# EAGLE board M8650D+vrs (EAGLE 6.6.0), part 1 of 2
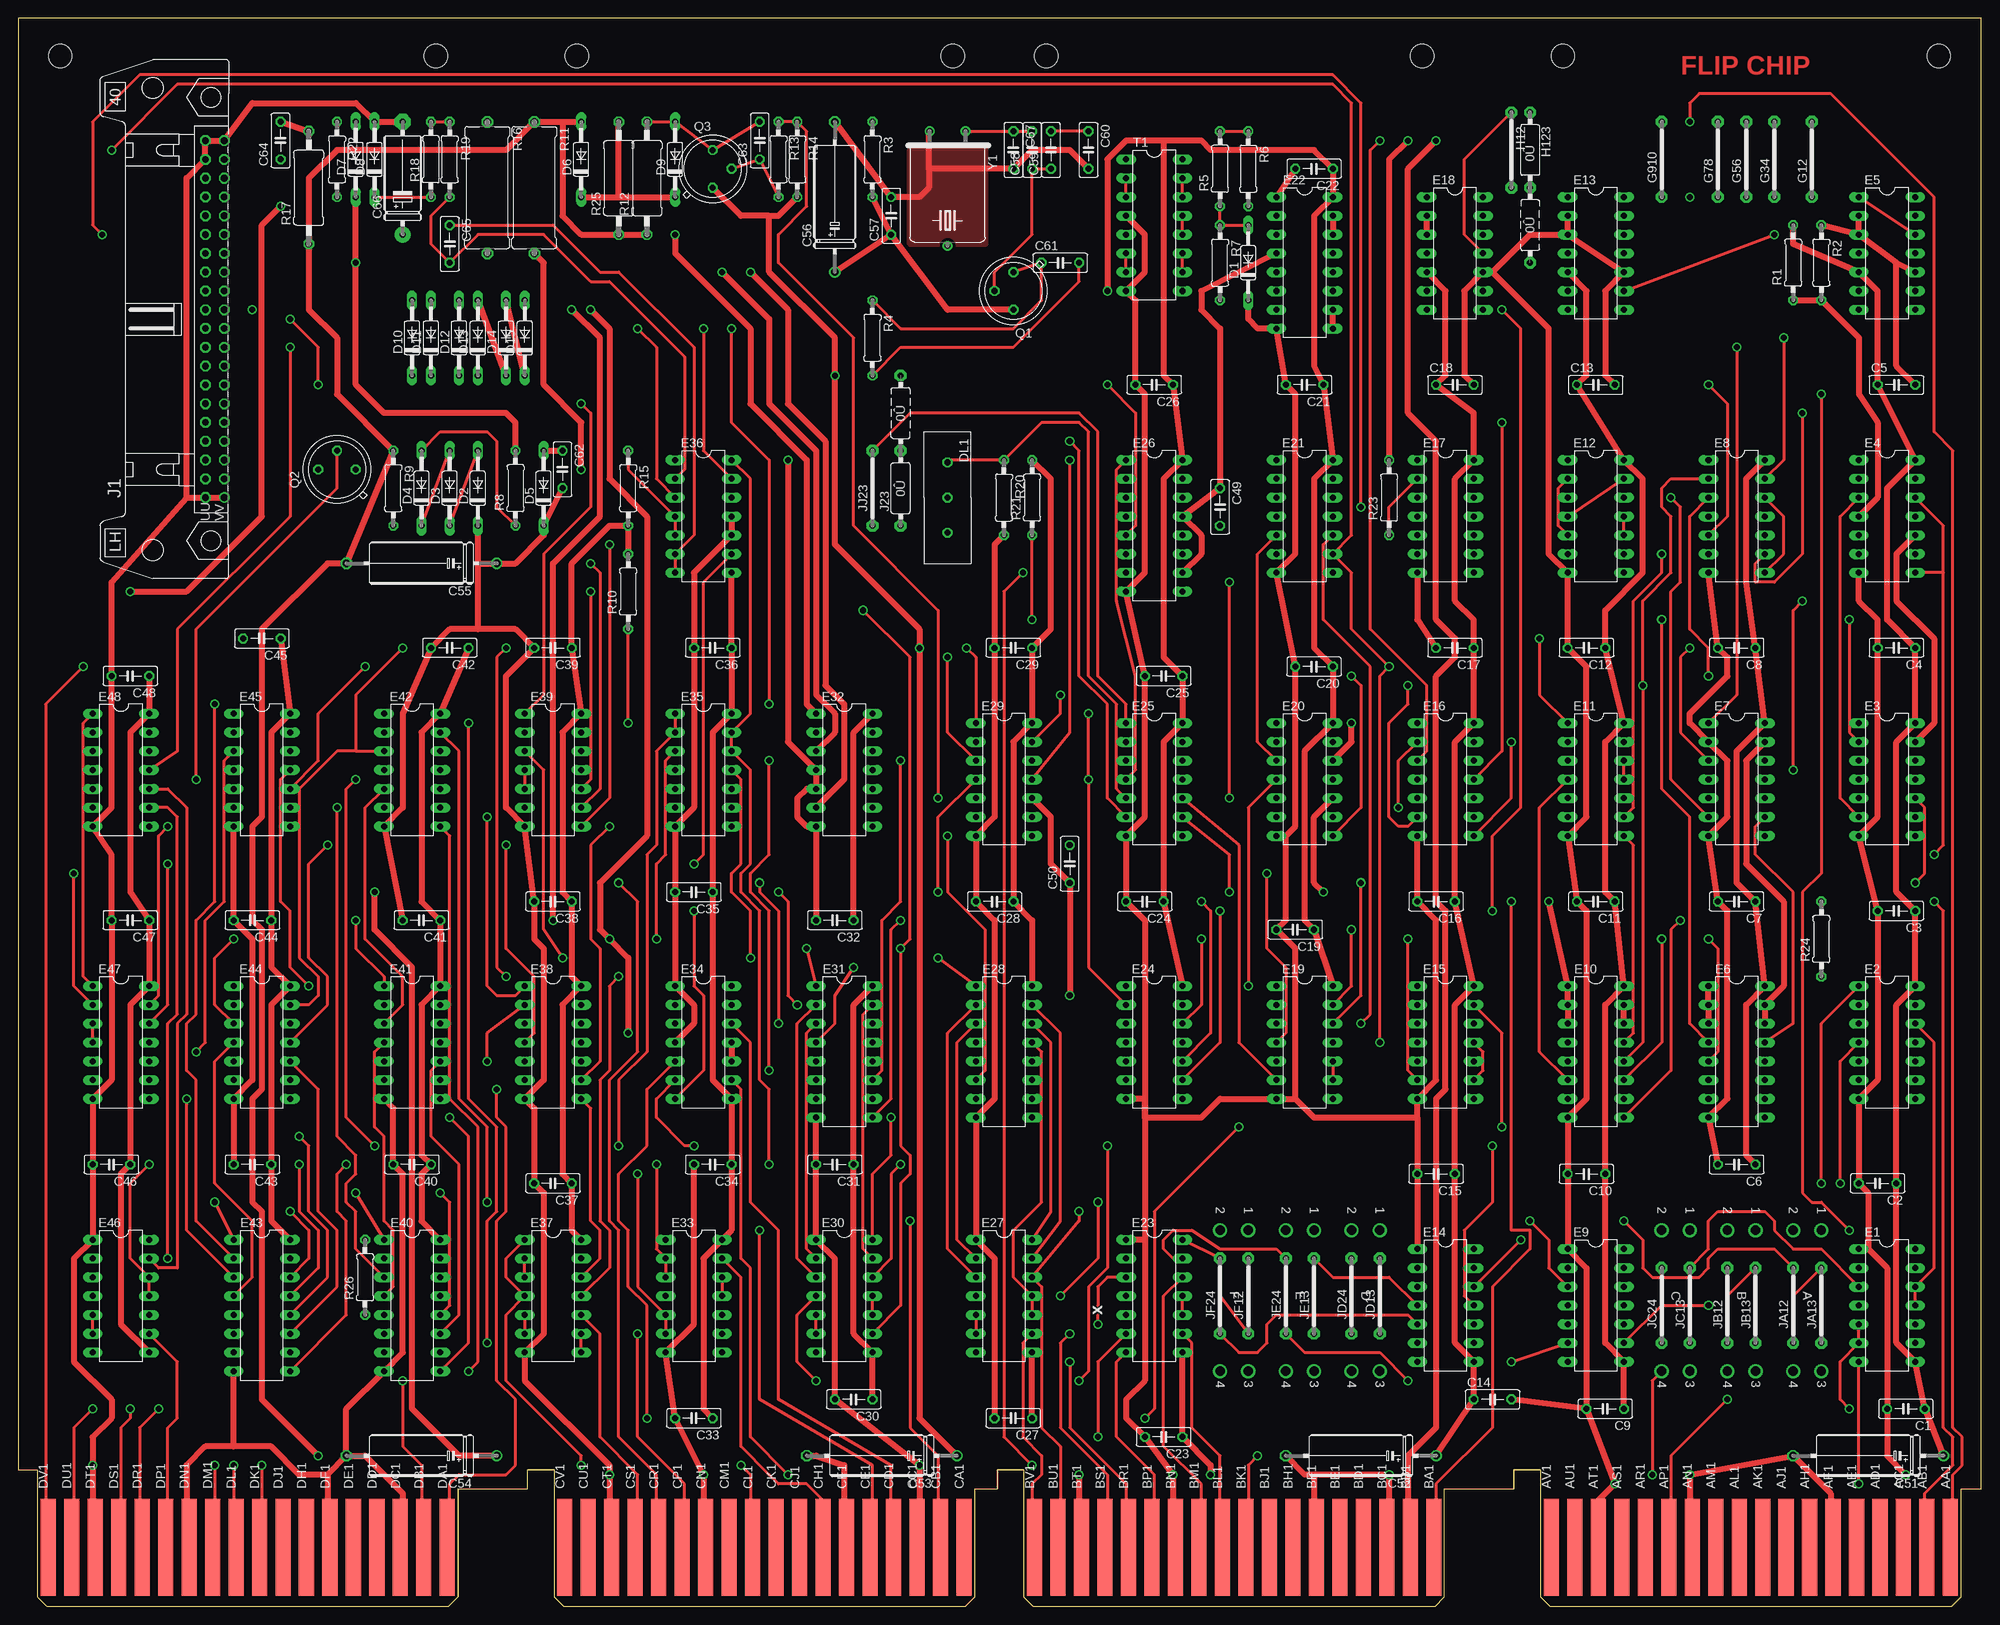
[diagram p2: board, top side]
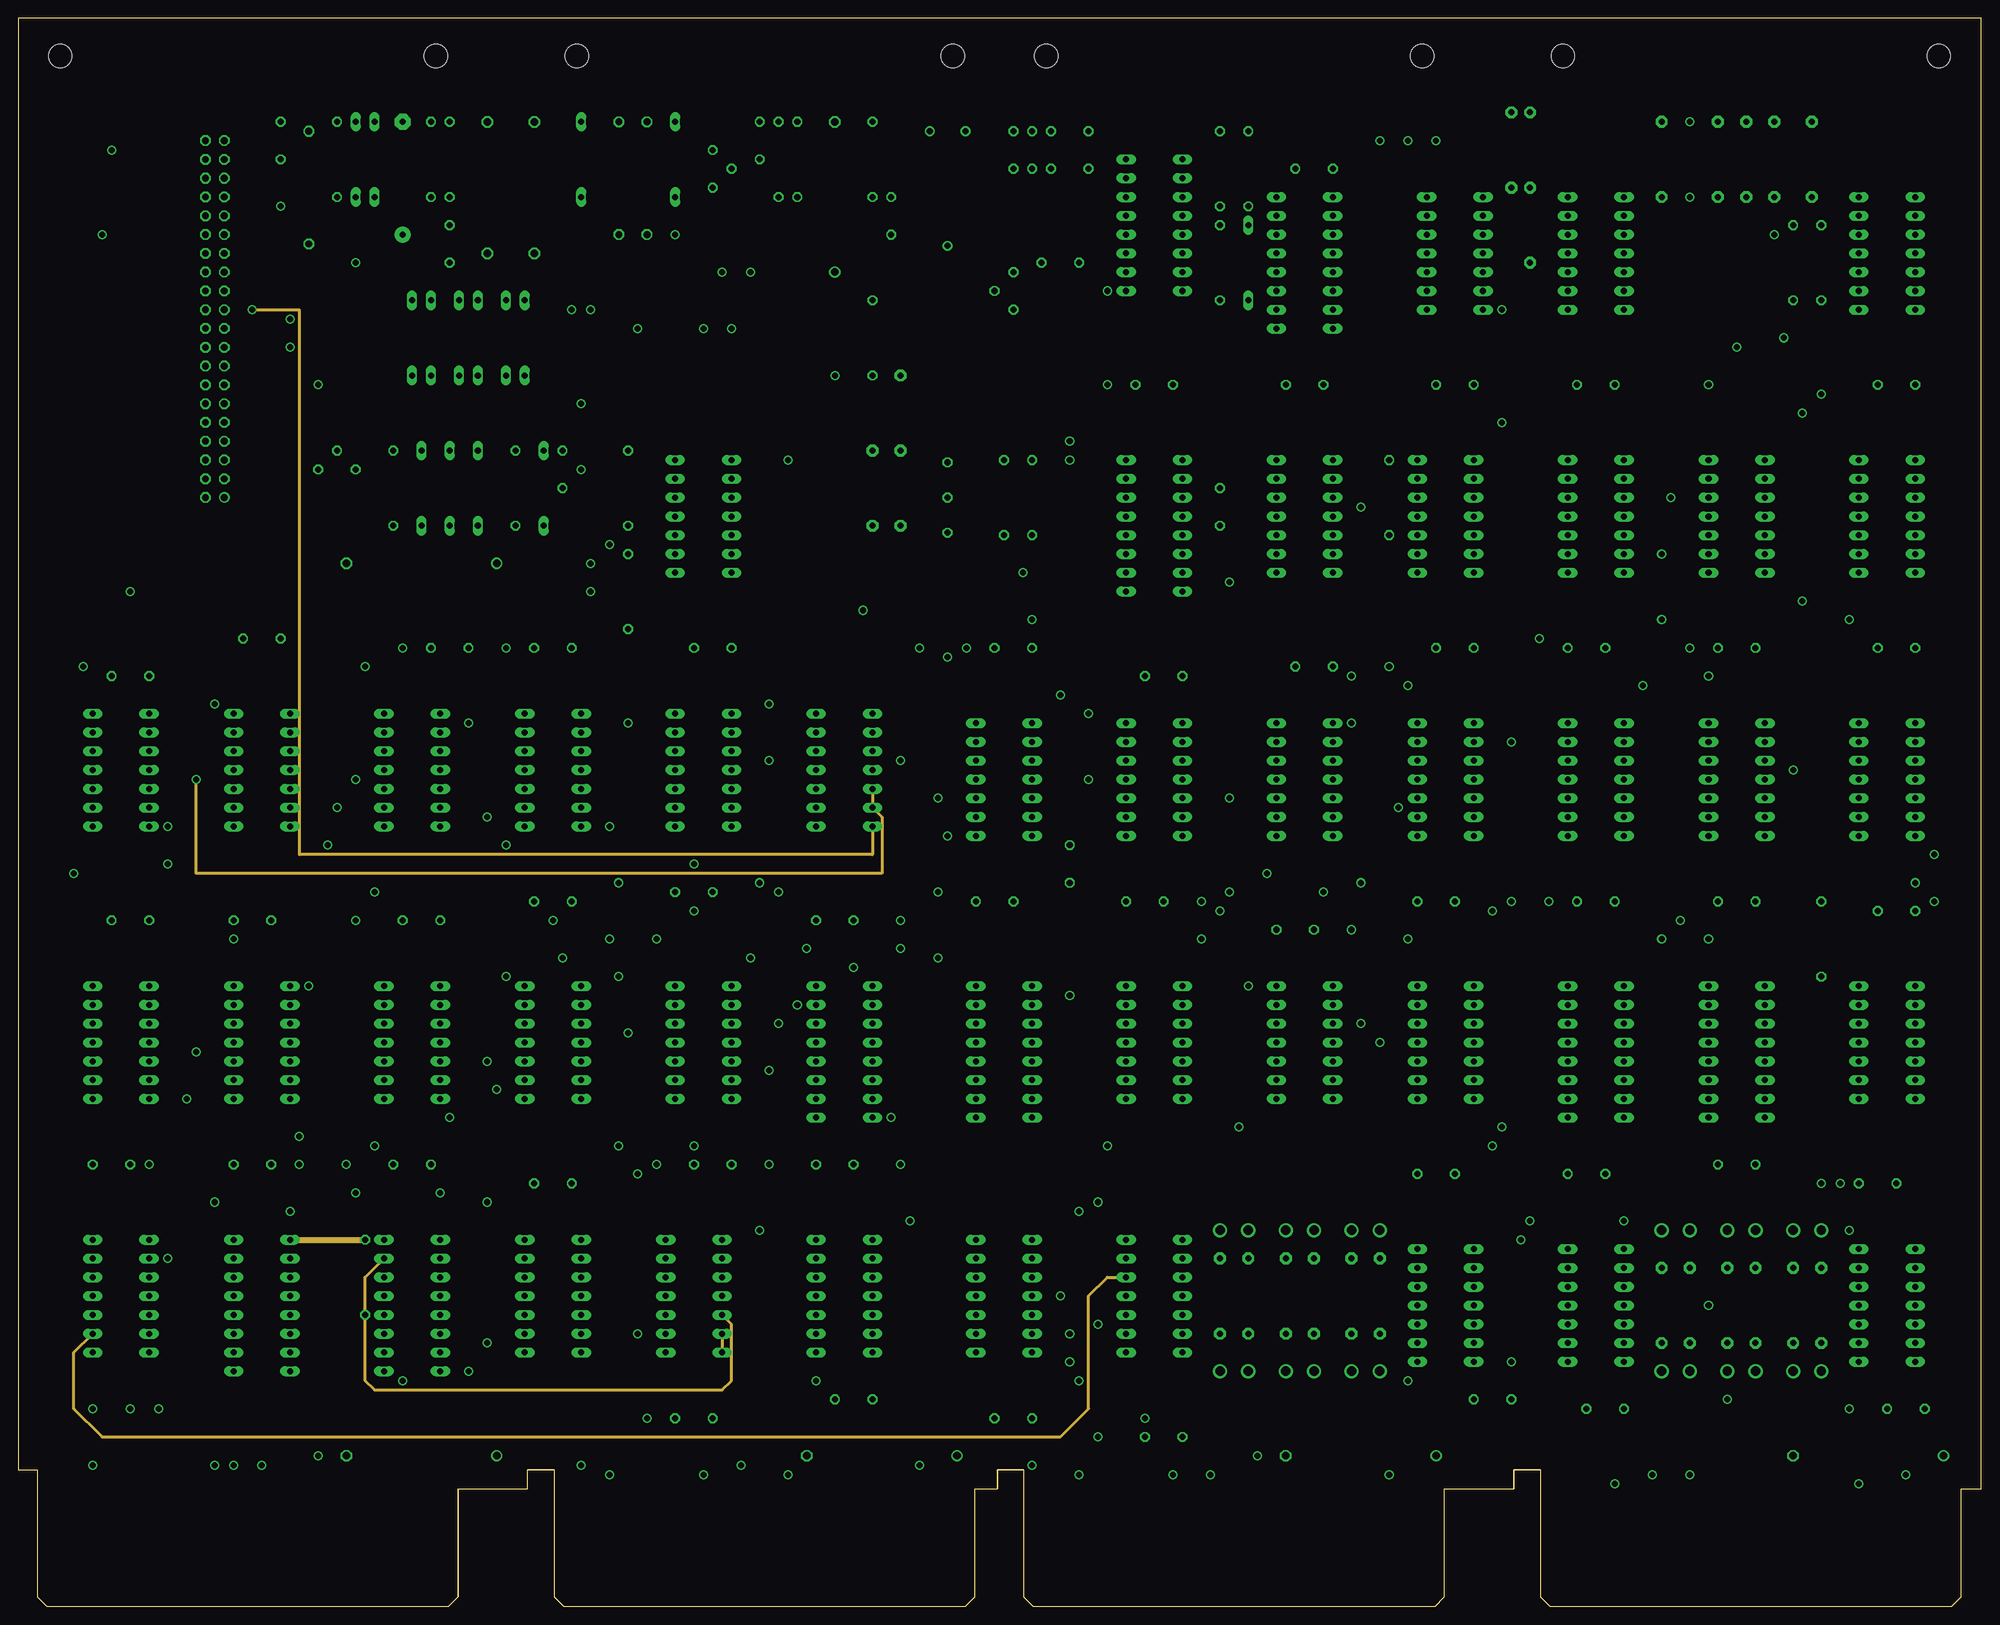
[diagram p3: board, inner layer ECO1]
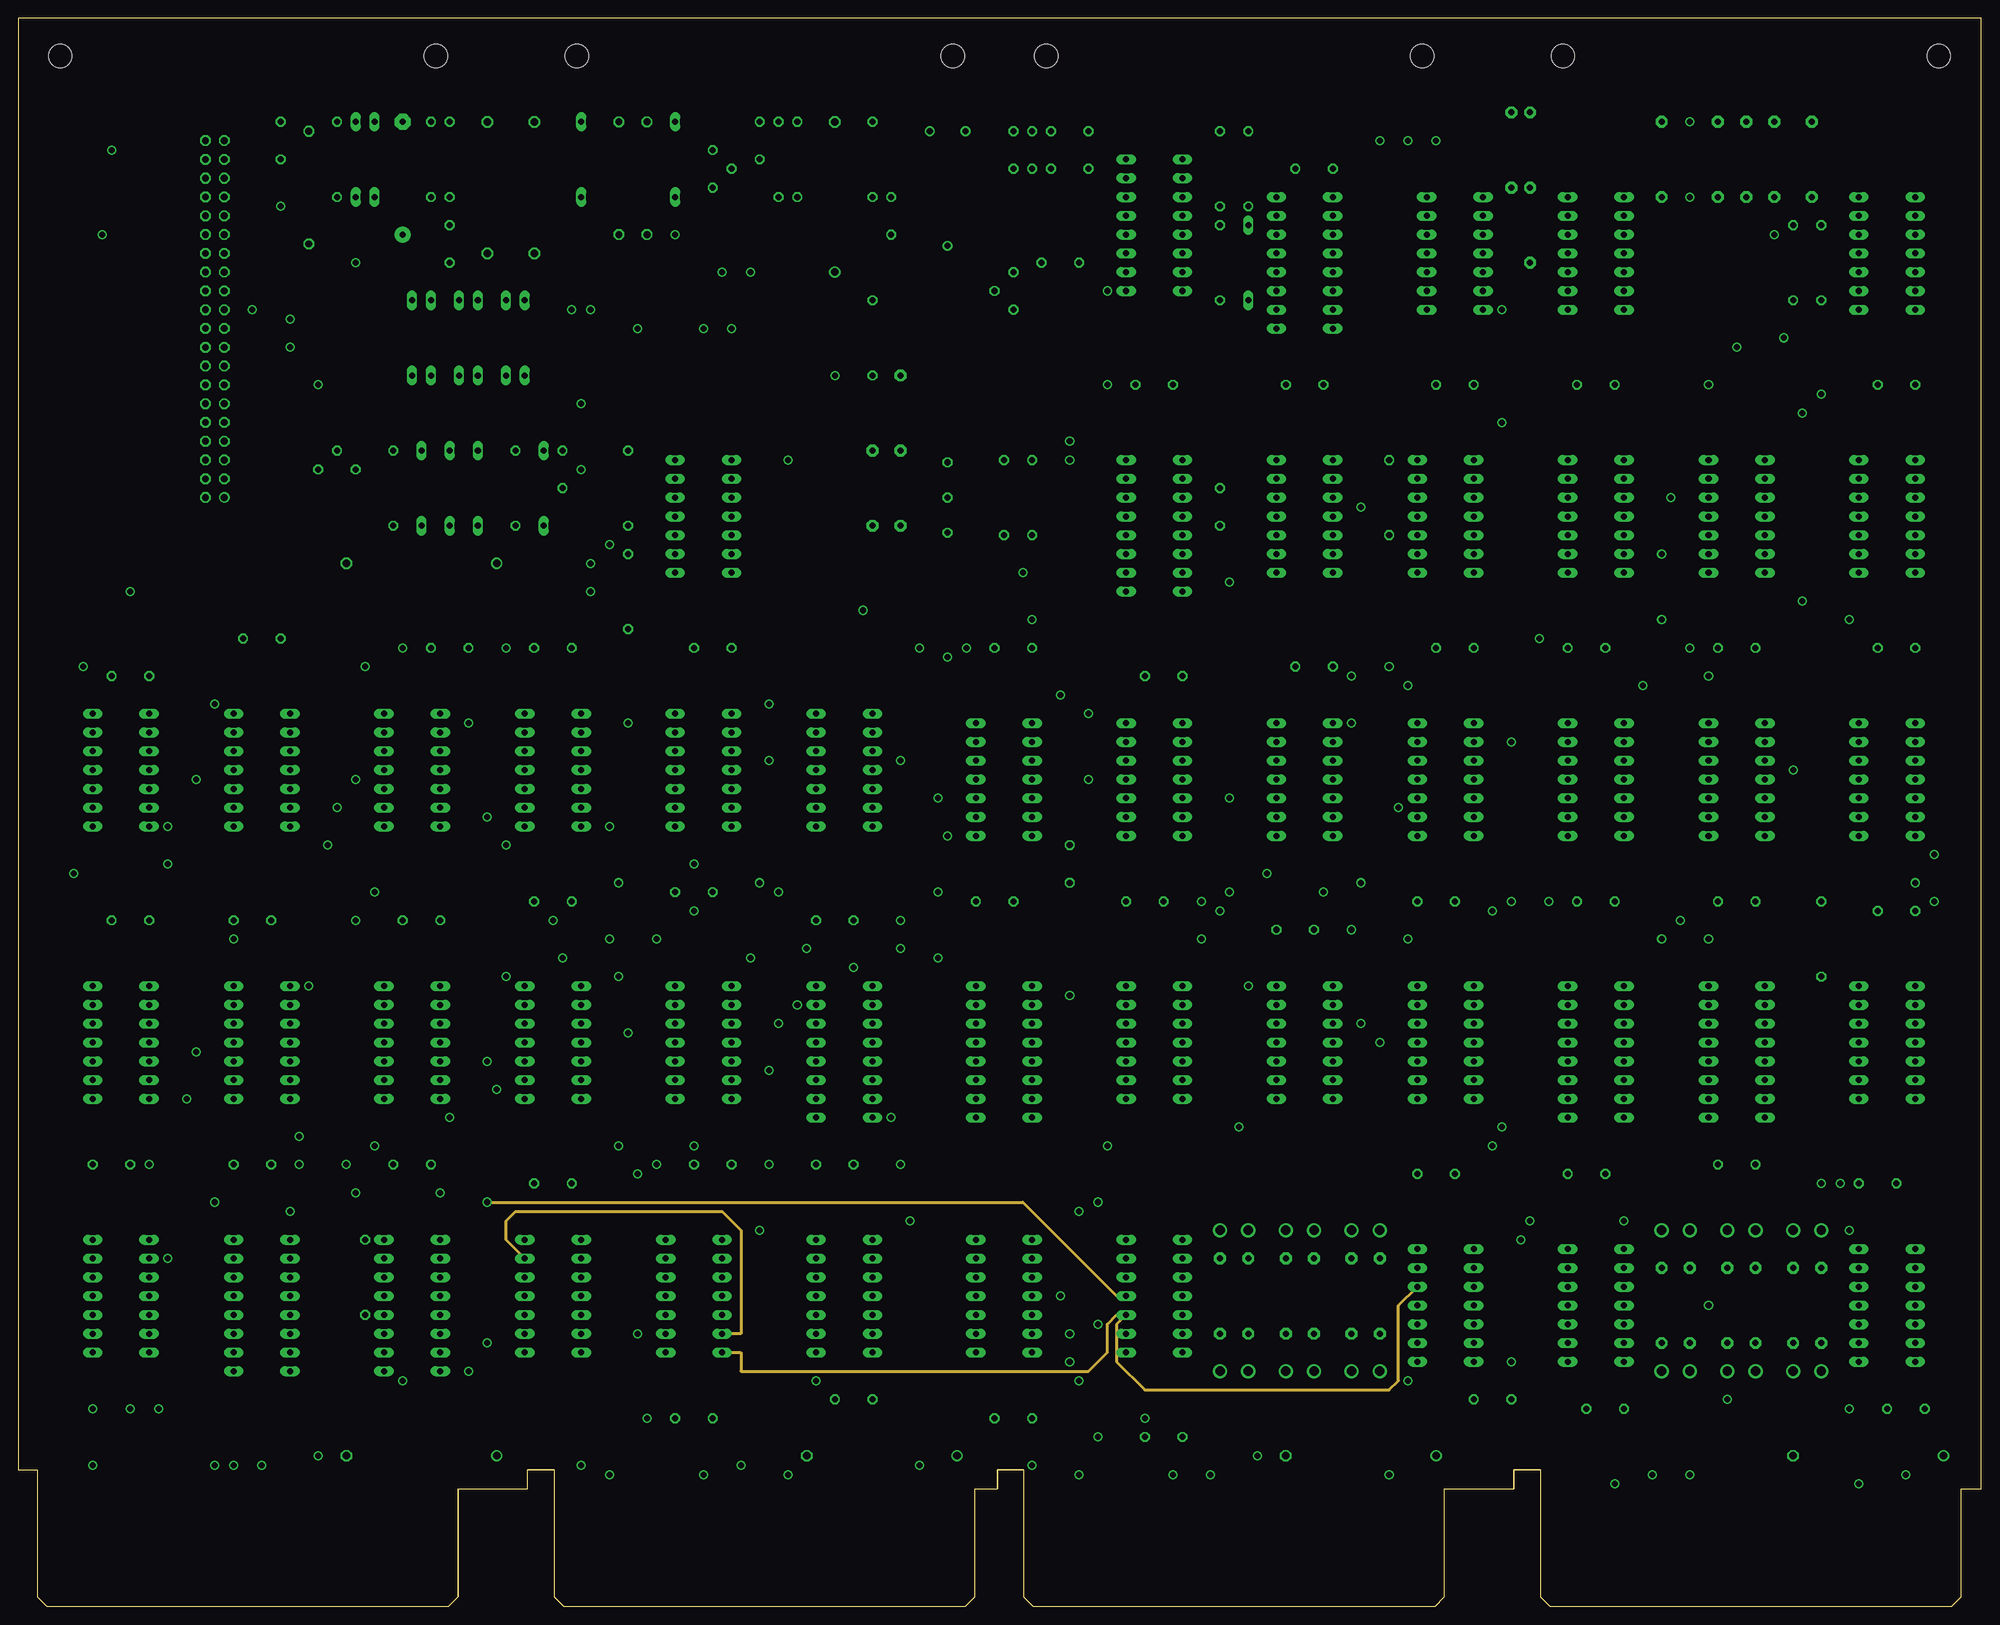
[diagram p4: board, inner layer ECO2]
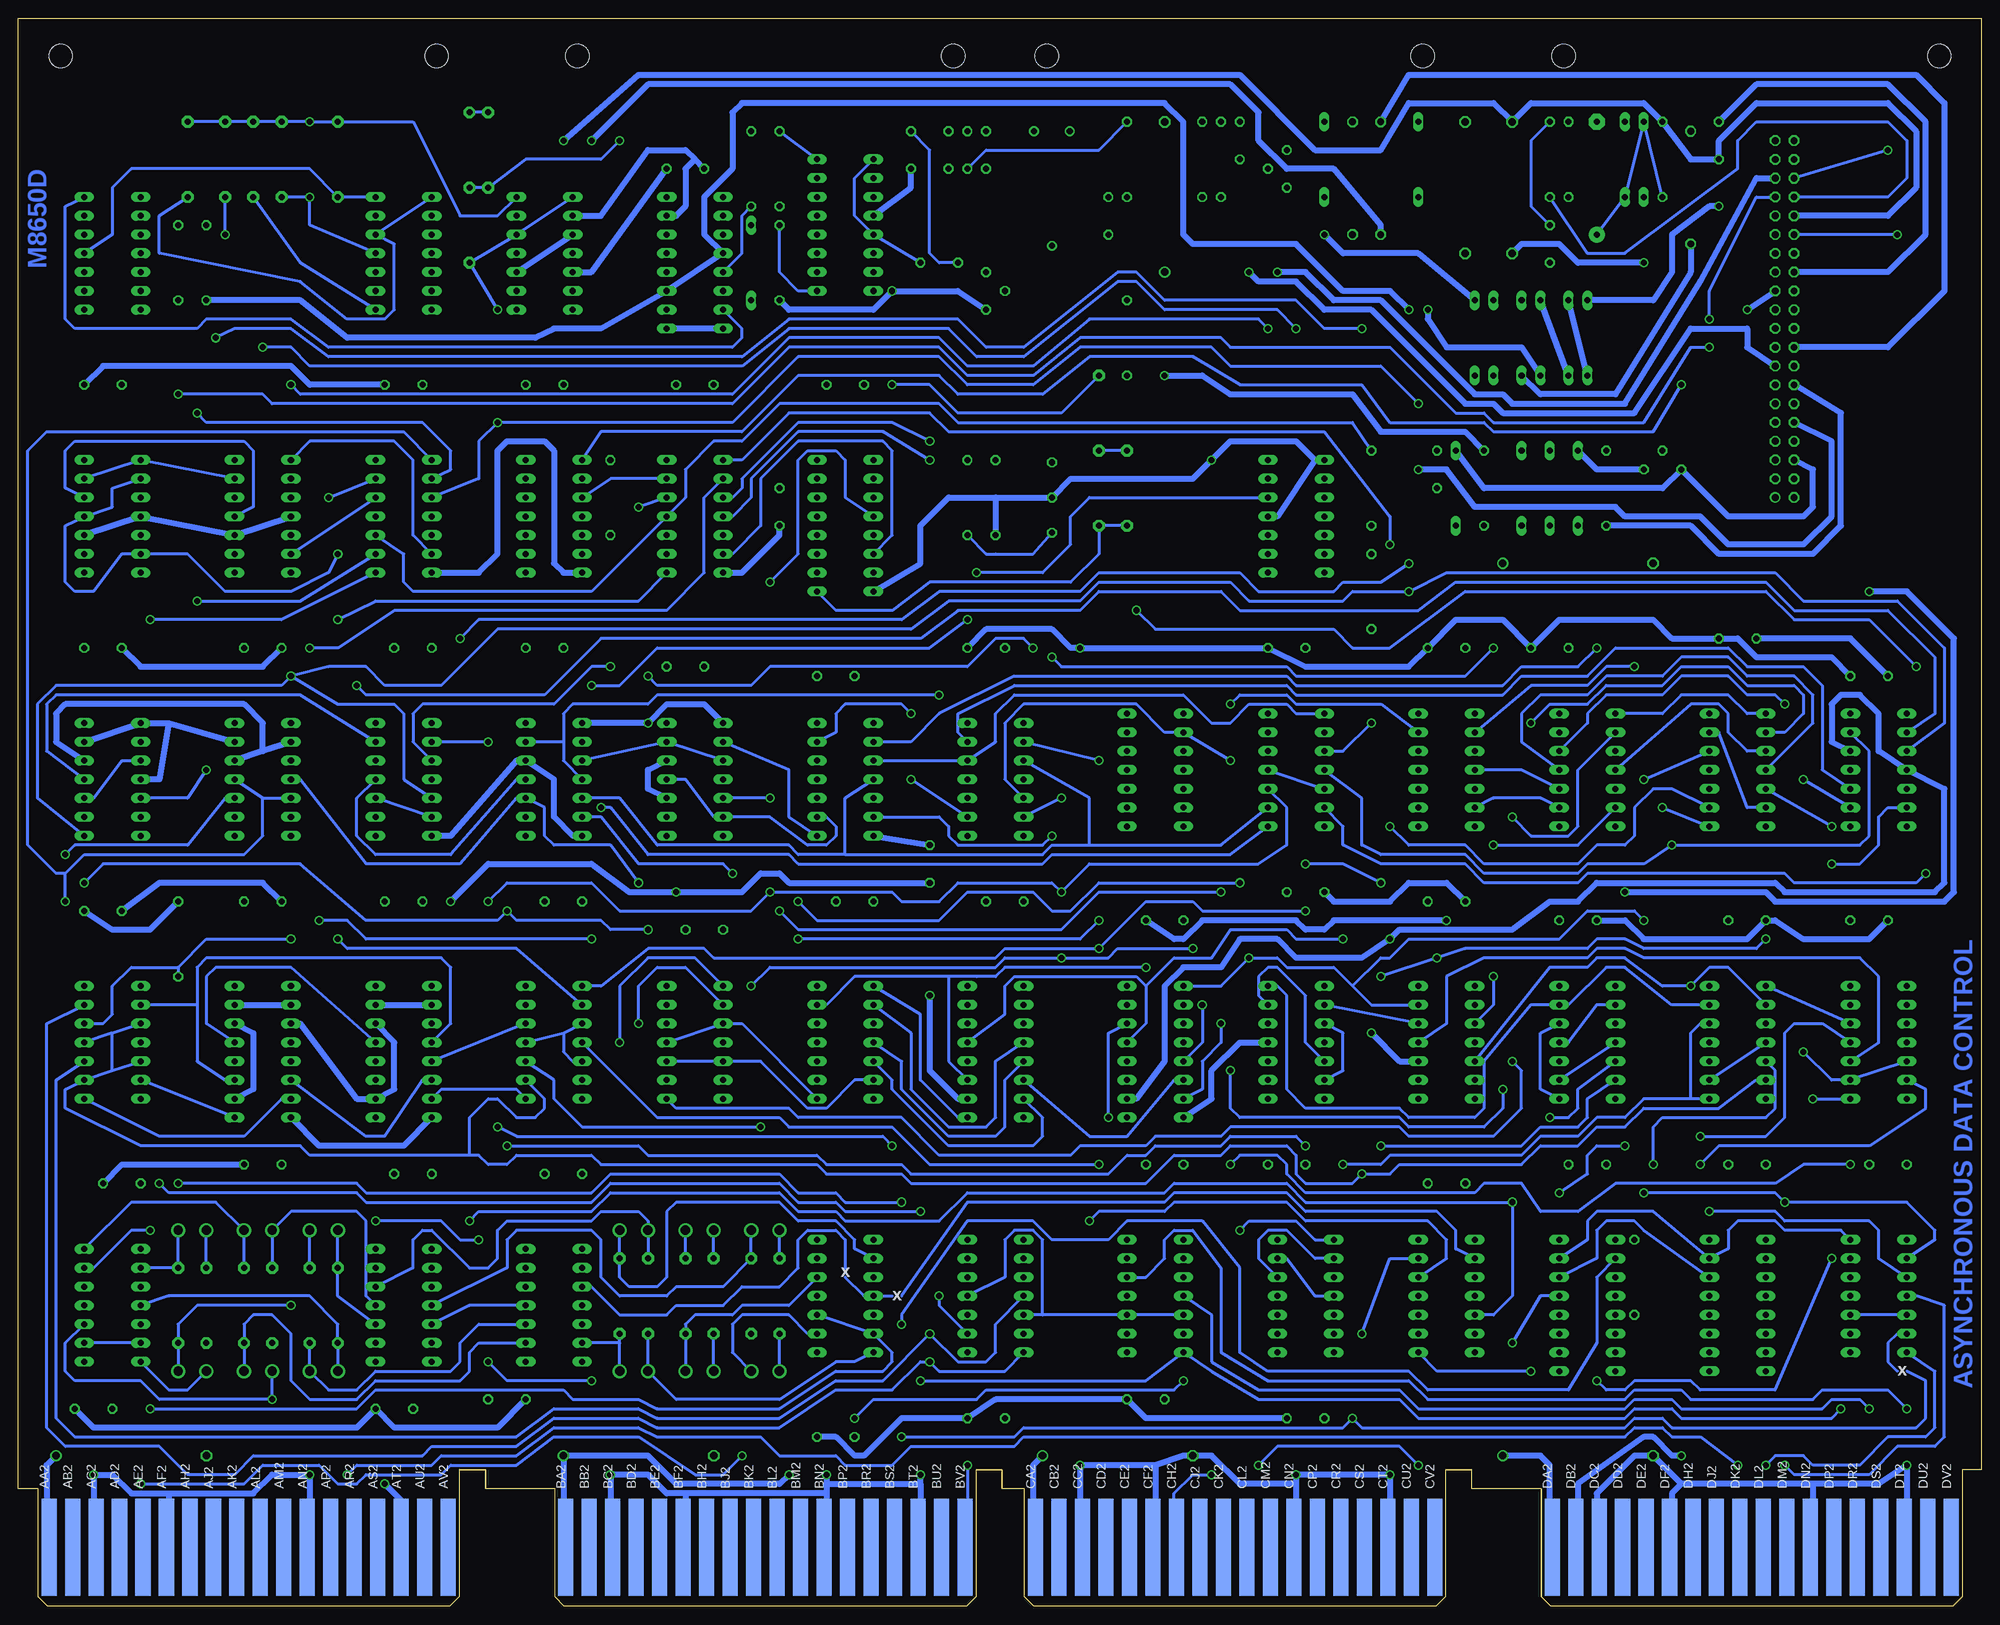
[diagram p5: board, bottom side, seen from below]

Size 265.3 x 214.63 mm. Coordinates in mm from the lower left corner, seen from the top.
Copper layers (1+2+15+16): Top 0.035mm / dielectric 1.5mm / ECO1 0.035mm / dielectric 0.15mm / ECO2 0.035mm / dielectric 0.2mm / Bottom 0.035mm
Design rules "16mils *": minimum track width 16mil, minimum drill 32mil, track to track 15mil, track to pad 10mil, pad to pad 10mil, via to via 10mil, smd to smd 10mil, copper to edge 13mil, drill to drill 10mil, minimum pad ring 10mil, minimum via ring 8mil, stop-mask expansion 0mil, vias tented up to drill 0mil, thermal gap 10mil
Net classes: 1 Supply: width 0.813 mm

## Footprints (pad centres in the part's own frame; a part is rotated, then mirrored left to right if it is on the bottom)
JUMPER4 = drill 1.27: 1 3.81,13.97; 2 0,13.97; 3 3.81,-5.08; 4 0,-5.08
C050-025X075 = drill 0.813 octagon: 1 -2.54,0; 2 2.54,0
E12-8 = drill 1.016: + -10.16,0 | drill 1.016 octagon: - 10.16,0
E15-5 = drill 0.813 pad 2.159: + -7.62,0 | drill 0.813 pad 2.159 octagon: - 7.62,0
DO35-10 = drill 0.813 long: A 5.08,0; C -5.08,0
RCL-L-00-05 = drill 0.813 octagon: 1 4.763,0; 2 0,0; 3 -4.763,0
DIL14 = drill 0.813 long: 1 -7.62,-3.81; 2 -5.08,-3.81; 3 -2.54,-3.81; 4 0,-3.81; 5 2.54,-3.81; 6 5.08,-3.81; 7 7.62,-3.81; 8 7.62,3.81; 9 5.08,3.81; 10 2.54,3.81; 11 0,3.81; 12 -2.54,3.81; 13 -5.08,3.81; 14 -7.62,3.81
DIL16 = drill 0.813 long: 1 -8.89,-3.81; 2 -6.35,-3.81; 3 -3.81,-3.81; 4 -1.27,-3.81; 5 1.27,-3.81; 6 3.81,-3.81; 7 6.35,-3.81; 8 8.89,-3.81; 9 8.89,3.81; 10 6.35,3.81; 11 3.81,3.81; 12 1.27,3.81; 13 -1.27,3.81; 14 -3.81,3.81; 15 -6.35,3.81; 16 -8.89,3.81
10 = drill 0.813 pad 1.6 octagon: 1 -5.08,0; 2 5.08,0
0R2/10 = drill 0.813 pad 1.6 octagon: 1 -5.08,0; 2 5.08,0; 3 15.24,0
DEC40PINH = drill 0.914 octagon: A 24.13,1.27; AA -3.81,1.27; B 24.13,-1.27; BB -3.81,-1.27; C 21.59,1.27; CC -6.35,1.27; D 21.59,-1.27; DD -6.35,-1.27; E 19.05,1.27; EE -8.89,1.27; F 19.05,-1.27; FF -8.89,-1.27; H 16.51,1.27; HH -11.43,1.27; J 16.51,-1.27; JJ -11.43,-1.27; K 13.97,1.27; KK -13.97,1.27; L 13.97,-1.27; LL -13.97,-1.27; M 11.43,1.27; MM -16.51,1.27; N 11.43,-1.27; NN -16.51,-1.27; P 8.89,1.27; PP -19.05,1.27; R 8.89,-1.27; RR -19.05,-1.27; S 6.35,1.27; SS -21.59,1.27; T 6.35,-1.27; TT -21.59,-1.27; U 3.81,1.27; UU -24.13,1.27; V 3.81,-1.27; W 1.27,1.27; X 1.27,-1.27; Y -1.27,1.27; Z -1.27,-1.27 | drill 0.914: VV -24.13,-1.27
TO5 = drill 0.813 octagon: 1 0,-2.54; 2 2.54,0; 3 0,2.54
0207/10 = drill 0.813 octagon: 1 -5.08,0; 2 5.08,0
0617/17 = drill 1.016 octagon: 1 -8.89,0; 2 8.89,0
0411/15 = drill 0.914 octagon: 1 -7.62,0; 2 7.62,0
OMNIBUS = hole 3.175: 208.915,209.55; 259.715,209.55; 189.865,209.55; 139.065,209.55; 75.616,209.55; 126.416,209.55; 56.566,209.55; 5.766,209.55
EDGE-CON8 = smd 2.032 x 13.106: AA1 261.303,7.938; AB1 258.127,7.938; AC1 254.952,7.938; AD1 251.778,7.938; AE1 248.602,7.938; AF1 245.428,7.938; AH1 242.252,7.938; AJ1 239.077,7.938; AK1 235.903,7.938; AL1 232.727,7.938; AM1 229.553,7.938; AN1 226.377,7.938; AP1 223.202,7.938; AR1 220.028,7.938; AS1 216.852,7.938; AT1 213.678,7.938; AU1 210.502,7.938; AV1 207.327,7.938; BA1 191.452,7.938; BB1 188.278,7.938; BC1 185.102,7.938; BD1 181.928,7.938; BE1 178.752,7.938; BF1 175.577,7.938; BH1 172.403,7.938; BJ1 169.227,7.938; BK1 166.053,7.938; BL1 162.877,7.938; BM1 159.702,7.938; BN1 156.528,7.938; BP1 153.352,7.938; BR1 150.178,7.938; BS1 147.002,7.938; BT1 143.827,7.938; BU1 140.653,7.938; BV1 137.477,7.938; CA1 127.953,7.938; CB1 124.778,7.938; CC1 121.603,7.938; CD1 118.427,7.938; CE1 115.252,7.938; CF1 112.078,7.938; CH1 108.903,7.938; CJ1 105.728,7.938; CK1 102.552,7.938; CL1 99.377,7.938; CM1 96.203,7.938; CN1 93.028,7.938; CP1 89.853,7.938; CR1 86.677,7.938; CS1 83.502,7.938; CT1 80.328,7.938; CU1 77.153,7.938; CV1 73.978,7.938; DA1 58.102,7.938; DB1 54.928,7.938; DC1 51.752,7.938; DD1 48.578,7.938; DE1 45.403,7.938; DF1 42.227,7.938; DH1 39.053,7.938; DJ1 35.877,7.938; DK1 32.703,7.938; DL1 29.527,7.938; DM1 26.352,7.938; DN1 23.177,7.938; DP1 20.003,7.938; DR1 16.828,7.938; DS1 13.652,7.938; DT1 10.477,7.938; DU1 7.303,7.938; DV1 4.128,7.938 | smd 2.032 x 13.106 bottom: AA2 261.303,7.938; AB2 258.127,7.938; AC2 254.952,7.938; AD2 251.778,7.938; AE2 248.602,7.938; AF2 245.428,7.938; AH2 242.252,7.938; AJ2 239.077,7.938; AK2 235.903,7.938; AL2 232.727,7.938; AM2 229.553,7.938; AN2 226.377,7.938; AP2 223.202,7.938; AR2 220.028,7.938; AS2 216.852,7.938; AT2 213.678,7.938; AU2 210.502,7.938; AV2 207.327,7.938; BA2 191.452,7.938; BB2 188.278,7.938; BC2 185.102,7.938; BD2 181.928,7.938; BE2 178.752,7.938; BF2 175.577,7.938; BH2 172.403,7.938; BJ2 169.227,7.938; BK2 166.053,7.938; BL2 162.877,7.938; BM2 159.702,7.938; BN2 156.528,7.938; BP2 153.352,7.938; BR2 150.178,7.938; BS2 147.002,7.938; BT2 143.827,7.938; BU2 140.653,7.938; BV2 137.477,7.938; CA2 127.953,7.938; CB2 124.778,7.938; CC2 121.603,7.938; CD2 118.427,7.938; CE2 115.252,7.938; CF2 112.078,7.938; CH2 108.903,7.938; CJ2 105.728,7.938; CK2 102.552,7.938; CL2 99.377,7.938; CM2 96.203,7.938; CN2 93.028,7.938; CP2 89.853,7.938; CR2 86.677,7.938; CS2 83.502,7.938; CT2 80.328,7.938; CU2 77.153,7.938; CV2 73.978,7.938; DA2 58.102,7.938; DB2 54.928,7.938; DC2 51.752,7.938; DD2 48.578,7.938; DE2 45.403,7.938; DF2 42.227,7.938; DH2 39.053,7.938; DJ2 35.877,7.938; DK2 32.703,7.938; DL2 29.527,7.938; DM2 26.352,7.938; DN2 23.177,7.938; DP2 20.003,7.938; DR2 16.828,7.938; DS2 13.652,7.938; DT2 10.477,7.938; DU2 7.303,7.938; DV2 4.128,7.938
HC49TL-H = drill 0.813: 1 -2.413,-7.62; 2 2.413,-7.62; 3 0,7.874

## Placement (x,y rotation side)
A  [JUMPER4]  239.9,36.83 0 top
B  [JUMPER4]  231.01,36.83 0 top
C  [JUMPER4]  222.12,36.83 0 top
C1  .01uF  [C050-025X075]  255.14,26.67 180 top
C2  .01uF  [C050-025X075]  251.33,57.15 180 top
C3  .01uF  [C050-025X075]  253.87,93.98 180 top
C4  .01uF  [C050-025X075]  253.87,129.54 180 top
C5  .01uF  [C050-025X075]  253.87,165.1 0 top
C6  .01uF  [C050-025X075]  232.28,59.69 180 top
C7  .01uF  [C050-025X075]  232.28,95.25 180 top
C8  .01uF  [C050-025X075]  232.28,129.54 180 top
C9  .01uF  [C050-025X075]  214.5,26.67 180 top
C10  .01uF  [C050-025X075]  211.96,58.42 180 top
C11  .01uF  [C050-025X075]  213.23,95.25 180 top
C12  .01uF  [C050-025X075]  211.96,129.54 180 top
C13  .01uF  [C050-025X075]  213.23,165.1 0 top
C14  .01uF  [C050-025X075]  199.26,27.94 0 top
C15  .01uF  [C050-025X075]  191.64,58.42 180 top
C16  .01uF  [C050-025X075]  191.64,95.25 180 top
C17  .01uF  [C050-025X075]  194.18,129.54 180 top
C18  .01uF  [C050-025X075]  194.18,165.1 0 top
C19  .01uF  [C050-025X075]  172.59,91.44 180 top
C20  .01uF  [C050-025X075]  175.13,127 180 top
C21  .01uF  [C050-025X075]  173.86,165.1 180 top
C22  .01uF  [C050-025X075]  175.13,194.31 180 top
C23  .01uF  [C050-025X075]  154.81,22.86 180 top
C24  .01uF  [C050-025X075]  152.27,95.25 180 top
C25  .01uF  [C050-025X075]  154.81,125.73 180 top
C26  .01uF  [C050-025X075]  153.54,165.1 180 top
C27  .01uF  [C050-025X075]  134.49,25.4 180 top
C28  .01uF  [C050-025X075]  131.95,95.25 180 top
C29  .01uF  [C050-025X075]  134.49,129.54 180 top
C30  .01uF  [C050-025X075]  112.9,27.94 180 top
C31  .01uF  [C050-025X075]  110.36,59.69 180 top
C32  .01uF  [C050-025X075]  110.36,92.71 180 top
C33  .01uF  [C050-025X075]  91.31,25.4 180 top
C34  .01uF  [C050-025X075]  93.85,59.69 180 top
C35  .01uF  [C050-025X075]  91.31,96.52 180 top
C36  .01uF  [C050-025X075]  93.85,129.54 180 top
C37  .01uF  [C050-025X075]  72.26,57.15 180 top
C38  .01uF  [C050-025X075]  72.26,95.25 180 top
C39  .01uF  [C050-025X075]  72.26,129.54 180 top
C40  .01uF  [C050-025X075]  53.21,59.69 180 top
C41  .01uF  [C050-025X075]  54.48,92.71 180 top
C42  .01uF  [C050-025X075]  58.29,129.54 180 top
C43  .01uF  [C050-025X075]  31.62,59.69 180 top
C44  .01uF  [C050-025X075]  31.62,92.71 180 top
C45  .01uF  [C050-025X075]  32.89,130.81 180 top
C46  .01uF  [C050-025X075]  12.57,59.69 180 top
C47  .01uF  [C050-025X075]  15.11,92.71 180 top
C48  .01uF  [C050-025X075]  15.11,125.73 180 top
C49  .01uF  [C050-025X075]  162.43,148.59 270 top
C50  .01uF  [C050-025X075]  142.11,100.33 90 top
C51  6.8uF  [E12-8]  250.06,20.32 180 top
C52  6.8uF  [E12-8]  181.48,20.32 180 top
C53  6.8uF  [E12-8]  116.71,20.32 180 top
C54  6.8uF  [E12-8]  54.48,20.32 180 top
C55  6.8uF  [E12-8]  54.48,140.97 180 top
C56  6.8uF  [E12-8]  110.36,190.5 90 top
C57  .047uF  [C050-025X075]  117.98,187.96 90 top
C58  33pF  [C050-025X075]  137.03,196.85 90 top
C59  100pF  [C050-025X075]  139.57,196.85 90 top
C60  68pF  [C050-025X075]  144.65,196.85 270 top
C61  .047uF  [C050-025X075]  140.84,181.61 0 top
C62  .01uF  [C050-025X075]  73.53,153.67 270 top
C63  .001uF  [C050-025X075]  100.2,198.12 90 top
C64  .01uF  [C050-025X075]  35.43,198.12 90 top
C65  10pF  [C050-025X075]  58.29,184.15 270 top
C66  .47uF  [E15-5]  51.94,193.04 90 top
C67  10pF  [C050-025X075]  134.49,196.85 270 top
D  [JUMPER4]  180.21,36.83 0 top
D1  1N645  [DO35-10]  166.24,181.61 90 top
D2  1N3606  [DO35-10]  62.1,151.13 90 top
D3  1N3606  [DO35-10]  58.29,151.13 90 top
D4  1N3606  [DO35-10]  54.48,151.13 90 top
D5  1N3606  [DO35-10]  70.99,151.13 90 top
D6  1N3606  [DO35-10]  76.07,195.58 90 top
D7  1N3606  [DO35-10]  45.59,195.58 90 top
D8  1N3606  [DO35-10]  48.13,195.58 90 top
D9  1N3606  [DO35-10]  88.77,195.58 90 top
D10  1N3606  [DO35-10]  53.21,171.45 90 top
D11  1N3606  [DO35-10]  55.75,171.45 90 top
D12  1N3606  [DO35-10]  59.56,171.45 90 top
D13  1N3606  [DO35-10]  62.1,171.45 90 top
D14  1N3606  [DO35-10]  65.91,171.45 90 top
D15  1N3606  [DO35-10]  68.45,171.45 90 top
DL1  RCL-L-100  [RCL-L-00-05]  125.6,149.86 270 top
E  [JUMPER4]  171.32,36.83 0 top
E1  SP380N  [DIL14]  252.6,40.64 270 top
E2  97401  [DIL14]  252.6,76.2 270 top
E3  7474N  [DIL14]  252.6,111.76 270 top
E4  7474N  [DIL14]  252.6,147.32 270 top
E5  7493N  [DIL14]  252.6,182.88 270 top
E6  DEC8271  [DIL16]  232.28,74.93 270 top
E7  7474N  [DIL14]  232.28,111.76 270 top
E8  7474N  [DIL14]  232.28,147.32 270 top
E9  SP314N  [DIL14]  213.23,40.64 270 top
E10  DEC8271  [DIL16]  213.23,74.93 270 top
E11  7402N  [DIL14]  213.23,111.76 270 top
E12  7400N  [DIL14]  213.23,147.32 270 top
E13  7493N  [DIL14]  213.23,182.88 270 top
E14  SP314N  [DIL14]  192.91,40.64 270 top
E15  97401  [DIL14]  192.91,76.2 270 top
E16  7474N  [DIL14]  192.91,111.76 270 top
E17  1489N  [DIL14]  192.91,147.32 270 top
E18  7493N  [DIL14]  194.18,182.88 270 top
E19  7410N  [DIL14]  173.86,76.2 270 top
E20  7474N  [DIL14]  173.86,111.76 270 top
E21  7404N  [DIL14]  173.86,147.32 270 top
E22  74193N  [DIL16]  173.86,181.61 270 top
E23  SP380N  [DIL14]  153.54,41.91 270 top
E24  N8815  [DIL14]  153.54,76.2 270 top
E25  7450N  [DIL14]  153.54,111.76 270 top
E26  DEC8271  [DIL16]  153.54,146.05 270 top
E27  SP380N  [DIL14]  133.22,41.91 270 top
E28  DEC8271  [DIL16]  133.22,74.93 270 top
E29  7474N  [DIL14]  133.22,111.76 270 top
E30  SP380N  [DIL14]  111.63,41.91 270 top
E31  DEC8271  [DIL16]  111.63,74.93 270 top
E32  1488N  [DIL14]  111.63,113.03 270 top
E33  97401  [DIL14]  91.31,41.91 270 top
E34  SP384N  [DIL14]  92.58,76.2 270 top
E35  74H00N  [DIL14]  92.58,113.03 270 top
E36  SP384N  [DIL14]  92.58,147.32 270 top
E37  97401  [DIL14]  72.26,41.91 270 top
E38  74S74N  [DIL14]  72.26,76.2 270 top
E39  7450N  [DIL14]  72.26,113.03 270 top
E40  DEC8251  [DIL16]  53.21,40.64 270 top
E41  7400N  [DIL14]  53.21,76.2 270 top
E42  7404N  [DIL14]  53.21,113.03 270 top
E43  DEC8251  [DIL16]  32.89,40.64 270 top
E44  7400N  [DIL14]  32.89,76.2 270 top
E45  7402N  [DIL14]  32.89,113.03 270 top
E46  SP380N  [DIL14]  13.84,41.91 270 top
E47  7402N  [DIL14]  13.84,76.2 270 top
E48  7474N  [DIL14]  13.84,113.03 270 top
F  [JUMPER4]  162.43,36.83 0 top
G12  J10MM  [10]  242.44,195.58 90 top
G34  J10MM  [10]  237.36,195.58 90 top
G56  J10MM  [10]  233.55,195.58 90 top
G78  J10MM  [10]  229.74,195.58 90 top
G910  J10MM  [10]  222.12,195.58 90 top
H12  J10MM  [10]  201.8,196.85 270 top
H123  [0R2/10]  204.34,196.85 270 top
J1  [DEC40PINH]  26.54,173.99 90 top
J23  [0R2/10]  119.25,151.13 90 top
JA12  [10]  239.9,40.64 90 top
JA13  [10]  243.71,40.64 90 top
JB12  [10]  231.01,40.64 90 top
JB13  [10]  234.82,40.64 90 top
JC13  [10]  225.93,40.64 90 top
JC24  [10]  222.12,40.64 90 top
JD13  [10]  184.02,41.91 90 top
JD24  [10]  180.21,41.91 90 top
JE13  [10]  175.13,41.91 90 top
JE24  [10]  171.32,41.91 90 top
JF12  [10]  166.24,41.91 90 top
JF24  [10]  162.43,41.91 90 top
JJ23  [10]  115.44,151.13 90 top
Q1  2N3009B  [TO5]  134.49,177.8 180 top
Q2  MPS6534  [TO5]  43.05,153.67 90 top
Q3  MPS6534D  [TO5]  93.85,194.31 0 top
R1  220  [0207/10]  239.9,181.61 90 top
R2  750  [0207/10]  243.71,181.61 270 top
R3  10K  [0207/10]  115.44,195.58 270 top
R4  220  [0207/10]  115.44,171.45 270 top
R5  3.3K  [0207/10]  162.43,194.31 90 top
R6  470  [0207/10]  166.24,194.31 270 top
R7  470  [0207/10]  162.43,181.61 270 top
R8  150  [0207/10]  67.18,151.13 90 top
R9  150  [0207/10]  50.67,151.13 270 top
R10  1K  [0207/10]  82.42,137.16 90 top
R11  750 1W  [0617/17]  69.72,191.77 270 top
R12  1.5K 1/2W  [0411/15]  84.96,193.04 90 top
R13  470  [0207/10]  102.74,195.58 270 top
R14  1.5K  [0207/10]  105.28,195.58 270 top
R15  1K  [0207/10]  82.42,151.13 270 top
R16  750 1W  [0617/17]  63.37,191.77 270 top
R17  560 1/2W  [0411/15]  39.24,191.77 90 top
R18  3.3K  [0207/10]  55.75,195.58 90 top
R19  10K  [0207/10]  58.29,195.58 270 top
R20  220  [0207/10]  133.22,149.86 270 top
R21  330  [0207/10]  137.03,149.86 90 top
R22  82  [0207/10]  43.05,195.58 270 top
R23  30K  [0207/10]  185.29,149.86 90 top
R24  470  [0207/10]  243.71,90.17 90 top
R25  1.5K 1/2W  [0411/15]  81.15,193.04 90 top
R26  1K  [0207/10]  46.86,44.45 90 top
T1  16-09651  [DIL16]  153.54,186.69 270 top
U$1  OUTLINE-OMNIBUS  [OMNIBUS]  -0.13,0 0 top
U$2  [EDGE-CON8]  -0.13,0 0 top
U$3  [FLIPCHIP]  205.61,212.09 270 top
Y1  19.661 MHz  [HC49TL-H]  125.6,191.77 180 top

## Tracks (layer width: path | path; a pad name or v marks a point on that pad's centre or on a via)
!CKKCC  (via drill 0.81)
  Top 0.406: E44.11 41.78,81.28 41.78,85.09 39.24,87.63 39.24,100.33 v41.78,102.87
  Bottom 0.406: E35.4 83.69,109.22 83.69,102.87 81.15,101.6 69.72,101.6 67.18,99.06 54.48,99.06 53.21,100.33 45.59,100.33 v41.78,102.87 16.38,102.87 15.11,104.14 15.11,115.57 E48.13
!CKTFL  (via drill 0.81)
  Top 0.406: E38.1 67.18,82.55 64.64,82.55 63.37,83.82 v63.37,106.68
  Bottom 0.406: E42.2 54.48,113.03 54.48,105.41 55.75,104.14 60.83,104.14 v63.37,106.68
!DOTPC  (via drill 0.81)
  Top 0.406: E30.6 E30.5 | E30.10 E30.11 | E27.5 E27.6 | E27.10 E27.11 134.49,44.45 134.49,50.8 138.3,54.61 138.3,74.93 E28.13 | E35.3 87.5,114.3 87.5,101.6 86.23,100.33 v86.23,90.17 | v82.42,119.38 R10.1
  Bottom 0.406: E30.5 E30.10 126.87,39.37 | 126.87,39.37 E27.5 | 126.87,39.37 126.87,49.53 128.14,50.8 130.68,50.8 131.95,49.53 131.95,44.45 E27.11 | E35.3 86.23,115.57 v82.42,119.38 | E28.13 131.95,80.01 131.95,83.82 130.68,85.09 114.17,85.09 112.9,83.82 | E31.13 112.9,78.74 112.9,83.82 | 112.9,83.82 109.09,87.63 104.01,87.63 101.47,91.44 93.85,91.44 92.58,90.17 v86.23,90.17
!INIT  (via drill 0.81)
  Top 0.406: E46.13 18.92,45.72 21.46,45.72 21.46,78.74 22.73,80.01 22.73,107.95 20.19,110.49 E48.10 | E29.13 140.84,120.65 v140.84,123.19
  Bottom 0.406: 191.64,116.84 E16.13 | 191.64,116.84 191.64,114.3 E16.4 | 191.64,116.84 191.64,120.65 190.37,121.92 180.21,121.92 178.94,123.19 v140.84,123.19 | E48.10 21.46,113.03 21.46,124.46 24,127 31.62,127 34.16,129.54 49.4,129.54 53.21,125.73 62.1,125.73 64.64,123.19 92.58,123.19 93.85,124.46 130.68,124.46 138.3,120.65 138.3,118.11 E29.13
!INT_ENAB  (via drill 0.81)
  Top 0.406: E38.9 78.61,73.66 78.61,88.9 77.34,90.17 77.34,102.87 v79.88,105.41
  Bottom 0.406: E45.9 41.78,110.49 44.32,110.49 46.86,107.95 46.86,104.14 48.13,102.87 51.94,102.87 54.48,100.33 67.18,100.33 69.72,102.87 77.34,102.87 v79.88,105.41
!KCC
  Top 0.406: E43.11 43.05,43.18 43.05,50.8 40.51,53.34 40.51,69.85 E44.10
!KCF  (via drill 0.81)
  Top 0.406: E43.13 40.51,45.72 40.51,50.8 37.97,53.34 v37.97,59.69
  Bottom 0.406: E47.6 7.49,69.85 7.49,67.31 15.11,62.23 35.43,62.23 v37.97,59.69
!KIE  (via drill 0.81)
  Top 0.406: E43.3 22.73,50.8 v22.73,68.58
  Bottom 0.406: v22.73,68.58 E47.8
!KRB
  Top 0.406: E43.4 31.62,44.45 31.62,52.07 26.54,57.15 26.54,73.66 E44.4
  Bottom 0.406: E44.4 E44.9
!KRS  (via drill 0.81)
  Top 0.406: E43.9 44.32,39.37 44.32,52.07 43.05,53.34 43.05,58.42 v44.32,59.69
  Bottom 0.406: E44.5 27.81,72.39 27.81,67.31 29.08,66.04 43.05,66.04 44.32,64.77 v44.32,59.69
!KSF  (via drill 0.81)
  Top 0.406: E43.12 41.78,44.45 41.78,50.8 39.24,53.34 39.24,62.23 v37.97,63.5
  Bottom 0.406: E47.11 21.46,78.74 25.27,78.74 26.54,77.47 26.54,66.04 29.08,63.5 v37.97,63.5
!LAST_UNIT
  Bottom 0.406: E12.12 E8.6
!LINE  (via drill 0.81)
  Top 0.406: R13.1 R14.1 106.55,199.39 106.55,189.23 102.74,185.42 102.74,181.61 112.9,171.45 112.9,146.05 124.33,134.62 v124.33,109.22
  Bottom 0.406: v124.33,109.22 E29.6
!P_PULSE
  Top 0.406: E6.13 239.9,78.74 239.9,96.52 234.82,101.6 234.82,105.41 E7.9 | E10.13 218.31,77.47 218.31,102.87 E11.8
  Bottom 0.406: E10.13 228.47,86.36 238.63,86.36 239.9,85.09 239.9,78.74 E6.13
!R_RUN  (via drill 0.81)
  Top 0.406: U$2.DB1 54.48,8.26 54.48,19.05 51.94,21.59 v51.94,30.48 | E48.9 20.19,107.95 21.46,106.68 21.46,80.01 20.19,78.74 v20.19,46.99 | v24,111.76 24,132.08 43.05,151.13 Q2.2
  ECO1 0.406: E32.10 E32.9 116.71,106.68 116.71,99.06 24,99.06 v24,111.76
  Bottom 0.406: v20.19,46.99 27.81,29.21 37.97,29.21 39.24,30.48 46.86,30.48 48.13,29.21 50.67,29.21 v51.94,30.48 | E48.9 v24,111.76
!RFLG  (via drill 0.81)
  Top 0.406: v20.19,100.33 20.19,81.28 E47.12
  Bottom 0.406: E47.12 E44.1 | E48.6 12.57,107.95 13.84,106.68 13.84,102.87 16.38,100.33 v20.19,100.33
!RX_ACTIVE  (via drill 0.81)
  Top 0.406: E12.13 E12.4 | v223.39,149.86 224.66,148.59 224.66,138.43 223.39,137.16 223.39,111.76 E7.6
  Bottom 0.406: v223.39,149.86 E12.13
!RX_ACTIVE8  (via drill 0.81)
  Top 0.406: E11.11 E11.12 | v76.07,162.56 77.34,161.29 77.34,148.59 70.99,142.24 70.99,123.19 E39.1 | v200.53,160.02 200.53,116.84 200.53,115.57 E16.11
  Bottom 0.406: E16.11 197.99,111.76 206.88,101.6 217.04,101.6 219.58,104.14 219.58,109.22 E11.11 | E12.3 203.07,152.4 203.07,157.48 v200.53,160.02 168.78,160.02 159.89,168.91 140.84,168.91 137.03,165.1 128.14,165.1 121.79,170.18 104.01,170.18 101.47,167.64 81.15,167.64 v76.07,162.56
!RX_AGAIN  (via drill 0.81)
  Top 0.406: E19.12 181.48,82.55 v181.48,97.79
  Bottom 0.406: E7.4 227.2,111.76 218.31,100.33 205.61,100.33 197.99,109.22 E16.10 194.18,107.95 194.18,104.14 192.91,102.87 185.29,102.87 v181.48,97.79
!RX_DIV
  Top 0.406: E3.6 246.25,109.22 246.25,147.32 E4.3
!RX_DIV2  (via drill 0.81)
  Top 0.406: v222.12,142.24 222.12,139.7 218.31,135.89 218.31,107.95 E11.9
  Bottom 0.406: E4.2 252.6,151.13 252.6,148.59 E4.11 258.95,146.05 258.95,138.43 257.68,137.16 255.14,137.16 251.33,142.24 E4.6 242.44,142.24 237.36,137.16 228.47,137.16 223.39,139.7 v222.12,142.24
!RX_DIV4  (via drill 0.81)
  Top 0.406: v258.95,101.6 260.22,102.87 260.22,139.7 | 260.22,139.7 E4.8 | E4.12 260.22,146.05 260.22,139.7
  Bottom 0.406: E4.12 258.95,151.13 258.95,156.21 257.68,157.48 234.82,157.48 233.55,156.21 233.55,148.59 E8.11 | E7.10 237.36,109.22 242.44,102.87 257.68,102.87 v258.95,101.6
!RX_LAST
  Top 0.406: E12.10 E12.11 | E36.5 E36.4 82.42,153.67 R15.1
  Bottom 0.406: E12.10 213.23,142.24 213.23,138.43 211.96,137.16 187.83,137.16 E21.11 175.13,149.86 175.13,153.67 171.32,157.48 167.51,157.48 162.43,162.56 140.84,162.56 138.3,160.02 84.96,160.02 R15.1
!SPIKE_DET  (via drill 0.81)
  Top 0.406: E16.8 201.8,109.22 v201.8,116.84
  Bottom 0.406: v201.8,116.84 E11.2
!START  (via drill 0.81)
  Top 0.406: E29.1 129.41,128.27 v128.14,129.54 | E20.8 181.48,107.95 181.48,124.46 v180.21,125.73
  Bottom 0.406: v128.14,129.54 129.41,130.81 133.22,130.81 137.03,127 163.7,127 166.24,124.46 178.94,124.46 v180.21,125.73
!TCF
  Top 0.406: E40.11 59.56,39.37 59.56,59.69 55.75,63.5 55.75,72.39 E41.10
!TFL  (via drill 0.81)
  Top 0.406: v63.37,35.56 63.37,52.07 64.64,53.34 64.64,64.77 60.83,68.58 v60.83,119.38
  Bottom 0.406: E40.13 59.56,41.91 v63.37,35.56 | E45.2 26.54,118.11 24,120.65 24,123.19 25.27,124.46 31.62,124.46 34.16,127 40.51,127 43.05,124.46 50.67,124.46 53.21,121.92 58.29,121.92 v60.83,119.38
!TFLG  (via drill 0.81)
  Top 0.406: v39.24,83.82 36.7,86.36 36.7,93.98 35.43,95.25 35.43,111.76 E45.11
  Bottom 0.406: E44.2 34.16,86.36 36.7,86.36 v39.24,83.82 43.05,83.82 48.13,87.63 51.94,87.63 53.21,86.36 58.29,86.36 E38.5
!TLS
  Top 0.406: E40.4 50.67,43.18 50.67,50.8 49.4,52.07 49.4,62.23 49.4,63.5 48.13,64.77 48.13,74.93 E41.4
  Bottom 0.406: E41.4 E41.9
!TP3  (via drill 0.81)
  Top 0.406: v24,74.93 25.27,76.2 25.27,92.71 27.81,95.25 27.81,114.3 E45.3
  Bottom 0.406: E47.5 E47.9 20.19,71.12 v24,74.93 | E42.4 39.24,121.92 35.43,121.92 34.16,120.65 34.16,118.11 31.62,115.57 E45.3
!TPC  (via drill 0.81)
  Top 0.406: E40.9 60.83,35.56 60.83,63.5 v58.29,66.04
  Bottom 0.406: E41.5 54.48,69.85 54.48,67.31 55.75,66.04 v58.29,66.04
!TSF  (via drill 0.81)
  Top 0.406: E40.12 58.29,40.64 58.29,54.61 v57.02,55.88 | v48.13,62.23 44.32,66.04 44.32,110.49 v45.59,111.76
  Bottom 0.406: v45.59,111.76 E45.12 | v48.13,62.23 51.94,62.23 53.21,60.96 53.21,58.42 v57.02,55.88
!TSK  (via drill 0.81)
  Top 0.406: E40.3 45.59,48.26 45.59,53.34 44.32,54.61 44.32,57.15 45.59,58.42 45.59,60.96 43.05,63.5 v43.05,107.95
  Bottom 0.406: v43.05,107.95 E45.8
!TX_ACTIVE  (via drill 0.81)
  Top 0.406: v163.7,109.22 v163.7,138.43
  Bottom 0.406: v163.7,109.22 E20.5 | E26.4 153.54,149.86 153.54,154.94 154.81,156.21 158.62,156.21 159.89,154.94 159.89,142.24 v163.7,138.43
!TX_DIV  (via drill 0.81)
  Top 0.406: v137.03,133.35 R21.1 | E19.4 171.32,77.47 171.32,86.36 168.78,88.9 v168.78,99.06 | E16.6 187.83,105.41 186.56,105.41 185.29,106.68 185.29,119.38 187.83,121.92 v187.83,124.46
  Bottom 0.406: E16.6 186.56,106.68 181.48,100.33 170.05,100.33 v168.78,99.06 | DL1.1 128.14,142.24 133.22,142.24 134.49,142.24 R21.1 | v137.03,133.35 142.11,129.54 178.94,129.54 184.02,124.46 v187.83,124.46
!TX_SHIFT  (via drill 0.81)
  Top 0.406: E28.6 130.68,72.39 130.68,91.44 125.6,96.52 v125.6,104.14 | v142.11,157.48 143.38,156.21 143.38,125.73 147.19,121.92 147.19,109.22 E25.6
  Bottom 0.406: E21.3 168.78,149.86 167.51,151.13 167.51,152.4 159.89,160.02 147.19,160.02 v142.11,157.48 | E31.6 109.09,71.12 115.44,63.5 120.52,63.5 E28.6 | E25.6 140.84,106.68 139.57,105.41 139.57,104.14 138.3,102.87 126.87,102.87 v125.6,104.14
+3V3  (via drill 0.81)
  Top 0.813: E6.14 E6.15 238.63,83.82 238.63,95.25 233.55,100.33 233.55,114.3 E7.13 | E6.3 E6.2 E6.1 | E10.3 E10.2 E10.1 v206.88,95.25 | E10.14 E10.15 | R1.1 R2.2 248.79,171.45 248.79,163.83 251.33,160.02 251.33,149.86 E4.4 | v142.11,82.55 C50.1 139.57,100.33 139.57,106.68 E29.10 | v77.34,175.26 79.88,172.72 79.88,152.4 84.96,147.32 84.96,104.14 78.61,97.79 78.61,91.44 v79.88,90.17 82.42,87.63 v82.42,77.47 | E3.13 258.95,119.38 258.95,130.81 253.87,135.89 253.87,142.24 E4.10 | E26.10 159.89,142.24 159.89,144.78 E26.13 C49.1 162.43,172.72 159.89,175.26 159.89,177.8 E22.4 | E20.12 180.21,116.84 v180.21,119.38 | v176.4,96.52 175.13,97.79 175.13,106.68 E20.10
  Bottom 0.813: E6.3 227.2,78.74 219.58,68.58 E10.10 214.5,69.85 214.5,76.2 E10.14 | E8.4 E8.10 E4.4 E4.10 | E6.15 E6.2 | E38.10 78.61,73.66 v82.42,77.47 | E3.13 E3.1 244.98,119.38 | 244.98,119.38 E7.13 | E3.4 246.25,111.76 244.98,119.38 | E20.10 180.21,110.49 180.21,113.03 E20.12 | E10.15 E10.2 | E6.10 233.55,69.85 233.55,77.47 E6.14 | E48.12 20.19,116.84 20.19,121.92 18.92,123.19 16.38,123.19 13.84,120.65 13.84,115.57 E48.4 4.95,110.49 4.95,97.79 6.22,96.52 26.54,96.52 27.81,97.79 51.94,97.79 54.48,95.25 58.29,95.25 63.37,91.44 78.61,91.44 v79.88,90.17 83.69,87.63 92.58,87.63 95.12,90.17 100.2,90.17 102.74,86.36 107.82,86.36 110.36,83.82 110.36,73.66 114.17,68.58 E31.10 | E28.10 138.3,68.58 142.11,72.39 v142.11,82.55 | v206.88,95.25 201.8,100.33 187.83,100.33 182.75,96.52 v176.4,96.52 167.51,96.52 164.97,99.06 162.43,99.06 161.16,97.79 C50.1 | E20.1 172.59,121.92 177.67,121.92 v180.21,119.38 E16.1 | v77.34,175.26 79.88,177.8 86.23,177.8 92.58,184.15 106.55,184.15 107.82,185.42 107.82,200.66 110.36,203.2 167.51,203.2 168.78,201.93 168.78,194.31 172.59,190.5 172.59,185.42 E22.4 E22.11 186.56,172.72 192.91,172.72 195.45,171.45 220.85,171.45 227.2,176.53 R1.1
+12V  (via drill 0.81)
  Top 0.813: v74.8,175.26 78.61,171.45 78.61,147.32 72.26,140.97 v72.26,92.71 | E32.14 112.9,118.11 C32.1
  Bottom 0.813: D12.C 62.1,170.18 72.26,170.18 74.8,173.99 v74.8,175.26 | C32.1 109.09,90.17 107.82,90.17 105.28,92.71 92.58,92.71 91.31,91.44 88.77,91.44 87.5,92.71 v72.26,92.71
+15V  (via drill 0.81)
  Top 0.813: C54.+ 59.56,20.32 53.21,26.67 53.21,86.36 48.13,91.44 v48.13,96.52 | v35.43,189.23 32.89,186.69 32.89,147.32 22.73,137.16 v15.11,137.16
  Bottom 0.813: U$2.DA2 58.29,8.26 58.29,19.05 59.56,20.32 C54.+ | D10.A 44.32,176.53 41.78,180.34 41.78,185.42 36.7,189.23 v35.43,189.23 | v15.11,137.16 10.03,137.16 3.68,130.81 3.68,96.52 4.95,95.25 27.81,95.25 29.08,96.52 v48.13,96.52
-12V  (via drill 0.81)
  Top 0.813: E32.1 106.55,121.92 106.55,154.94 98.93,162.56 98.93,172.72 88.77,182.88 v88.77,185.42
  Bottom 0.813: D15.A 76.07,182.88 86.23,182.88 v88.77,185.42
-15V  (via drill 0.81)
  Top 0.813: R12.1 R25.1 76.07,185.42 73.53,187.96 73.53,200.66 | 73.53,200.66 D6.A | 73.53,200.66 R11.1 65.91,196.85 43.05,196.85 39.24,193.04 R17.1 39.24,175.26 43.05,171.45 43.05,163.83 R9.1 C55.- 41.78,140.97 32.89,132.08 32.89,106.68 31.62,105.41 31.62,92.71 32.89,91.44 32.89,69.85 31.62,68.58 31.62,54.61 32.89,53.34 32.89,27.94 v40.51,20.32 | v187.83,198.12 185.29,195.58 R23.2
  Bottom 0.813: U$2.DB2 54.48,8.26 54.48,16.51 45.59,22.86 44.32,22.86 41.78,20.32 v40.51,20.32 | R17.1 39.24,180.34 49.4,163.83 59.56,163.83 D13.C | R25.1 81.15,186.69 87.5,194.31 93.85,194.31 97.66,198.12 97.66,201.93 101.47,205.74 180.21,205.74 v187.83,198.12
B_PAUSE_L  (via drill 0.81)
  Top 0.406: E1.5 E1.6 246.25,33.02 246.25,27.94 v247.52,26.67 | E23.10 E23.11 | E34.5 84.96,69.85 84.96,62.23 81.15,58.42 81.15,52.07 82.42,50.8 82.42,43.18 84.96,40.64 v84.96,25.4 | v145.92,22.86 145.92,33.02 E23.6
  Bottom 0.406: E1.6 E1.9 | v247.52,26.67 219.58,26.67 217.04,29.21 191.64,29.21 190.37,27.94 181.48,27.94 178.94,26.67 162.43,26.67 154.81,31.75 148.46,31.75 147.19,33.02 147.19,34.29 E23.6 E23.10 | E34.13 97.66,82.55 97.66,85.09 96.39,86.36 95.12,86.36 91.31,82.55 91.31,76.2 E34.5 | v145.92,22.86 130.68,22.86 129.41,24.13 86.23,24.13 v84.96,25.4 83.69,24.13 48.13,24.13 46.86,25.4 43.05,25.4 41.78,24.13 8.76,24.13 7.49,25.4 7.49,30.48 10.03,31.75
BD150  (via drill 0.81)
  Bottom 0.406: E13.11 225.93,186.69 v225.93,190.5 G78.1
BD300
  Bottom 0.406: E13.8 227.2,181.61 G56.1
BD600  (via drill 0.81)
  Top 0.406: E13.9 v237.36,185.42
  Bottom 0.406: v237.36,185.42 G34.1
BD1200
  Bottom 0.406: E13.1 E13.12 214.5,184.15 214.5,175.26 215.77,173.99 220.85,173.99 227.2,179.07 246.25,182.88 246.25,187.96 G12.1
BD2400
  Bottom 0.406: E13.14 G910.1 225.93,194.31 250.06,194.31 252.6,191.77 252.6,185.42 E5.11
BTP3  (via drill 0.81)
  Top 0.406: E44.13 39.24,81.28 40.51,82.55 40.51,85.09 37.97,87.63 37.97,110.49 43.05,115.57 45.59,115.57 | 45.59,115.57 E42.3 | v51.94,129.54 45.59,123.19 45.59,115.57
  Bottom 0.406: E44.13 41.78,81.28 48.13,86.36 50.67,86.36 55.75,81.28 E41.13 60.83,81.28 67.18,73.66 67.18,67.31 68.45,66.04 77.34,66.04 78.61,67.31 91.31,67.31 93.85,69.85 93.85,82.55 95.12,83.82 E34.14 | E25.2 144.65,116.84 140.84,120.65 130.68,125.73 93.85,125.73 92.58,124.46 64.64,124.46 62.1,127 54.48,127 v51.94,129.54
C0_L  (via drill 0.81)
  Top 0.406: U$2.CE1 115.44,8.89 115.44,19.05 100.2,27.94 v100.2,50.8
  Bottom 0.406: E33.1 90.04,49.53 92.58,52.07 98.93,52.07 v100.2,50.8
C1_L
  Top 0.406: U$2.CH1 109.09,8.89 109.09,13.97 106.55,16.51 102.74,16.51 101.47,17.78 97.66,21.59 97.66,44.45 E33.13
  Bottom 0.406: E33.4 90.04,41.91 93.85,46.99 E33.13
CK_PULSE  (via drill 0.81)
  Top 0.406: E39.10 77.34,111.76 v77.34,137.16 | E8.3 225.93,147.32 225.93,132.08 228.47,129.54 v228.47,125.73
  Bottom 0.406: E11.5 213.23,111.76 213.23,120.65 214.5,121.92 222.12,121.92 v228.47,125.73 | E48.3 4.95,119.38 4.95,129.54 11.3,135.89 24,135.89 27.81,139.7 72.26,139.7 v77.34,137.16 84.96,137.16 86.23,135.89 98.93,135.89 101.47,138.43 119.25,138.43 121.79,135.89 139.57,135.89 144.65,132.08 200.53,132.08 208.15,124.46 215.77,124.46 218.31,127 223.39,127 v228.47,125.73 | E3.8 262.76,109.22 262.76,121.92 260.22,124.46 229.74,124.46 v228.47,125.73
CKKCF
  Top 0.406: E47.4 E47.3
CKKIE
  Bottom 0.406: E47.10 13.84,76.2 13.84,85.09 16.38,87.63 45.59,87.63 48.13,88.9 51.94,88.9 53.21,87.63 67.18,87.63 72.26,85.09 72.26,78.74 E38.11
CKTCF
  Bottom 0.406: E41.2 51.94,81.28 55.75,76.2 E41.11
CKTFL
  Bottom 0.406: E42.1 43.05,120.65 40.51,123.19 34.16,123.19 31.62,120.65 E45.1
DATA04_L  (via drill 0.81)
  Top 0.406: U$2.BR1 149.73,8.89 149.73,16.51 142.11,24.13 v142.11,33.02
  Bottom 0.406: E2.13 261.49,78.74 261.49,24.13 258.95,21.59 246.25,21.59 242.44,17.78 236.09,17.78 233.55,20.32 210.69,20.32 209.42,21.59 197.99,21.59 192.91,25.4 181.48,25.4 178.94,24.13 162.43,24.13 154.81,29.21 147.19,29.21 143.38,33.02 v142.11,33.02 140.84,31.75 131.95,31.75 E27.7
DATA05_L  (via drill 0.81)
  Top 0.406: U$2.BS1 147.19,8.89 147.19,17.78 140.84,24.13 140.84,35.56 v142.11,36.83
  Bottom 0.406: E2.10 260.22,71.12 260.22,25.4 257.68,22.86 197.99,22.86 192.91,26.67 181.48,26.67 178.94,25.4 162.43,25.4 154.81,30.48 148.46,30.48 v142.11,36.83 138.3,33.02 134.49,33.02 133.22,34.29 133.22,38.1 E27.4
DATA06_L  (via drill 0.81)
  Top 0.406: E2.4 246.25,73.66 v246.25,57.15 | v143.38,53.34 143.38,52.07 E27.12 138.3,43.18 138.3,24.13 140.84,21.59 140.84,8.89 U$2.BU1
  Bottom 0.406: v143.38,53.34 153.54,53.34 154.81,54.61 159.89,54.61 162.43,57.15 185.29,57.15 187.83,54.61 218.31,54.61 219.58,55.88 244.98,55.88 v246.25,57.15
DATA07_L  (via drill 0.81)
  Top 0.406: E2.1 243.71,78.74 v243.71,57.15 | U$2.BV1 137.03,8.89 137.03,16.51 138.3,17.78 138.3,20.32 135.76,22.86 135.76,35.56 E27.9 | v140.84,41.91 145.92,46.99 v145.92,54.61
  Bottom 0.406: v140.84,41.91 140.84,40.64 E27.9 | v145.92,54.61 153.54,54.61 154.81,55.88 159.89,55.88 162.43,58.42 185.29,58.42 187.83,55.88 218.31,55.88 219.58,57.15 v243.71,57.15
DATA08_L  (via drill 0.81)
  Top 0.406: U$2.DR1 16.38,8.89 16.38,24.13 v18.92,26.67 | v143.38,30.48 144.65,31.75 144.65,43.18 147.19,45.72 v147.19,62.23 | E15.13 200.53,77.47 v200.53,64.77
  Bottom 0.406: v143.38,30.48 112.9,30.48 E30.7 104.01,31.75 97.66,27.94 78.61,27.94 76.07,25.4 48.13,25.4 46.86,26.67 41.78,26.67 40.51,25.4 20.19,25.4 v18.92,26.67 | v147.19,62.23 148.46,63.5 197.99,63.5 v200.53,64.77
DATA09_L  (via drill 0.81)
  Top 0.406: U$2.DS1 13.84,8.89 13.84,24.13 15.11,25.4 v15.11,26.67 | E30.4 105.28,39.37 105.28,33.02 v107.82,30.48 | v152.27,25.4 153.54,26.67 153.54,53.34 v164.97,64.77
  Bottom 0.406: E30.4 104.01,39.37 104.01,33.02 97.66,29.21 78.61,29.21 76.07,26.67 48.13,26.67 46.86,27.94 41.78,27.94 40.51,26.67 21.46,26.67 20.19,27.94 16.38,27.94 v15.11,26.67 | E15.10 192.91,71.12 192.91,68.58 189.1,64.77 v164.97,64.77 | v152.27,25.4 149.73,27.94 135.76,27.94 134.49,29.21 109.09,29.21 v107.82,30.48
DATA10_L  (via drill 0.81)
  Top 0.406: U$2.DU1 7.49,8.89 7.49,24.13 v10.03,26.67 | E30.12 117.98,46.99 117.98,58.42 v119.25,59.69
  Bottom 0.406: v10.03,26.67 12.57,29.21 21.46,29.21 22.73,27.94 39.24,27.94 40.51,29.21 46.86,29.21 48.13,27.94 74.8,27.94 77.34,30.48 96.39,30.48 102.74,34.29 102.74,45.72 106.55,50.8 109.09,50.8 110.36,49.53 110.36,46.99 112.9,44.45 E30.12 | v119.25,59.69 142.11,59.69 147.19,64.77 161.16,64.77 162.43,66.04 178.94,66.04 E15.4
DATA11_L  (via drill 0.81)
  Top 0.406: U$2.DV1 3.68,8.89 3.68,121.92 v8.76,127 | E30.9 119.25,40.64 119.25,57.15 120.52,58.42 120.52,60.96 119.25,62.23 v119.25,88.9 120.52,90.17 120.52,128.27 v114.17,134.62 | E34.7 92.58,72.39 92.58,82.55 91.31,83.82 v91.31,93.98
  Bottom 0.406: v8.76,127 15.11,133.35 25.27,133.35 29.08,137.16 69.72,137.16 79.88,129.54 84.96,129.54 87.5,132.08 111.63,132.08 v114.17,134.62 | E15.1 186.56,83.82 180.21,88.9 172.59,88.9 171.32,87.63 133.22,87.63 131.95,88.9 v119.25,88.9 112.9,95.25 106.55,95.25 105.28,93.98 v91.31,93.98
DOKCC  (via drill 0.81)
  Top 0.406: E33.3 E33.2 86.23,48.26 v86.23,59.69 | E33.12 E33.11
  Bottom 0.406: E44.12 37.97,78.74 39.24,77.47 39.24,68.58 | E44.8 39.24,68.58 | 39.24,68.58 45.59,68.58 48.13,66.04 51.94,66.04 54.48,63.5 59.56,63.5 62.1,60.96 79.88,60.96 81.15,59.69 v86.23,59.69 | E33.2 90.04,46.99 93.85,50.8 96.39,50.8 97.66,49.53 97.66,46.99 E33.12
DOKRS  (via drill 0.81)
  Top 0.406: E33.6 E33.5 83.69,43.18 v83.69,58.42 | E15.9 197.99,72.39 197.99,74.93 E15.11
  Bottom 0.406: 252.6,72.39 E2.5 | 252.6,72.39 E2.9 258.95,69.85 258.95,67.31 248.79,62.23 227.2,62.23 225.93,60.96 204.34,60.96 | 252.6,77.47 E2.3 | 252.6,77.47 E2.11 | 252.6,72.39 252.6,77.47 | E15.11 191.64,77.47 | 191.64,77.47 E15.3 | E15.5 190.37,73.66 191.64,74.93 191.64,77.47 | E44.6 30.35,71.12 35.43,67.31 45.59,67.31 48.13,64.77 51.94,64.77 54.48,62.23 59.56,62.23 62.1,59.69 78.61,59.69 79.88,58.42 v83.69,58.42 84.96,57.15 91.31,57.15 92.58,58.42 92.58,60.96 93.85,62.23 101.47,62.23 102.74,60.96 109.09,60.96 112.9,57.15 144.65,57.15 145.92,58.42 156.08,58.42 157.35,59.69 186.56,59.69 187.83,60.96 197.99,60.96 199.26,59.69 201.8,59.69 203.07,60.96 204.34,60.96 | E15.9 194.18,68.58 194.18,67.31 195.45,66.04 197.99,66.04 200.53,68.58 201.8,68.58 204.34,66.04 204.34,60.96
DOTCF
  Bottom 0.406: E41.8 59.56,69.85 59.56,77.47 E41.12
DOTPC  (via drill 0.81)
  Top 0.406: E35.1 E35.2 86.23,115.57 86.23,102.87 84.96,101.6 84.96,74.93 81.15,71.12 v81.15,62.23
  Bottom 0.406: E25.3 E29.12 133.22,116.84 133.22,120.65 130.68,123.19 107.82,123.19 104.01,119.38 101.47,119.38 98.93,121.92 93.85,121.92 92.58,120.65 E35.1 | E41.6 53.21,68.58 53.21,66.04 54.48,64.77 59.56,64.77 62.1,62.23 v81.15,62.23
EIA_IN  (via drill 0.81)
  Top 0.406: v36.7,173.99 40.51,170.18 v40.51,165.1
  Bottom 0.406: J1.J 30.35,190.5 36.7,177.8 v36.7,173.99 | v40.51,165.1 44.32,158.75 65.91,158.75 67.18,160.02 79.88,160.02 83.69,165.1 100.2,165.1 106.55,168.91 120.52,168.91 126.87,163.83 138.3,163.83 140.84,166.37 159.89,166.37 167.51,158.75 186.56,158.75 E17.1
EIA_OUT  (via drill 0.81)
  Top 0.813: E32.3 110.36,118.11 110.36,120.65 107.82,123.19 107.82,156.21 101.47,162.56 101.47,173.99 v95.12,180.34
  Bottom 0.813: J1.F 30.35,193.04 37.97,179.07 48.13,162.56 63.37,162.56 64.64,163.83 68.45,163.83 81.15,176.53 87.5,176.53 91.31,180.34 v95.12,180.34
ENAB  (via drill 0.81)
  Top 0.406: v144.65,120.65 v144.65,111.76 144.65,86.36 E24.2
  Bottom 0.406: v144.65,111.76 E29.9 | E28.4 133.22,73.66 133.22,66.04 134.49,64.77 139.57,64.77 144.65,69.85 144.65,77.47 E24.2 | E25.13 154.81,118.11 154.81,120.65 153.54,121.92 145.92,121.92 v144.65,120.65
FLGS  (via drill 0.81)
  Top 0.406: E44.3 26.54,81.28 26.54,87.63 v29.08,90.17 | v73.53,87.63 70.99,91.44 70.99,113.03 E39.3 | E37.11 79.88,45.72 79.88,50.8 78.61,52.07 78.61,71.12 79.88,72.39 79.88,83.82 v81.15,85.09
  Bottom 0.406: v29.08,90.17 30.35,88.9 45.59,88.9 48.13,90.17 51.94,90.17 53.21,88.9 69.72,88.9 v73.53,87.63 v81.15,85.09
GND  (via drill 0.81)
  Top 0.813: U$2.AF2 244.98,8.26 244.98,15.24 C51.- v225.93,17.78 225.93,8.89 U$2.AN2 | U$2.CT1 79.88,8.89 v79.88,17.78 79.88,19.05 68.45,30.48 E37.7 70.99,36.83 70.99,55.88 C37.2 69.72,67.31 E38.7 70.99,71.12 70.99,88.9 69.72,90.17 C38.2 E39.7 65.91,107.95 65.91,125.73 C39.2 67.18,132.08 62.1,132.08 | U$2.CN1 92.58,8.89 v92.58,17.78 C33.2 E33.7 91.31,38.1 C34.2 | U$2.CF1 111.63,8.89 111.63,19.05 107.82,20.32 C53.- | U$2.BT2 143.38,8.89 v143.38,17.78 | U$2.BN2 156.08,8.89 v156.08,17.78 C23.2 149.73,25.4 149.73,27.94 152.27,30.48 152.27,49.53 | U$2.BC2 185.29,8.89 v185.29,17.78 175.13,17.78 | U$2.AT2 213.23,8.89 213.23,13.97 v215.77,16.51 C9.2 | U$2.DT2 10.03,8.89 v10.03,19.05 10.03,22.86 12.57,25.4 12.57,27.94 7.49,33.02 7.49,46.99 E46.1 C46.2 E47.7 12.57,71.12 C47.2 12.57,101.6 E48.7 12.57,107.95 C48.2 12.57,138.43 22.73,149.86 | U$2.DN2 22.73,8.89 22.73,19.05 25.27,21.59 29.08,21.59 | 29.08,21.59 34.16,21.59 37.97,17.78 41.78,17.78 | 29.08,21.59 E43.8 | U$2.DC2 51.94,8.89 51.94,15.24 46.86,20.32 C54.- | C54.- 41.78,17.78 | U$2.DF2 41.78,8.89 41.78,17.78 | C54.- 44.32,26.67 E40.8 51.94,34.29 51.94,58.42 C40.2 50.67,67.31 E41.7 | U$2.CC1 121.79,8.89 v121.79,19.05 C30.2 110.36,46.99 E30.1 C31.2 E31.8 | E18.3 E18.2 | E13.3 E13.2 | E5.3 E5.2 | E36.11 E36.10 91.31,139.7 C36.2 91.31,107.95 E35.7 C35.2 E34.1 91.31,81.28 91.31,78.74 E34.4 | E34.11 E34.10 | C22.2 E22.1 | D1.C 166.24,173.99 167.51,172.72 E22.8 C21.2 172.59,163.83 172.59,142.24 E21.7 C20.2 172.59,105.41 171.32,104.14 | C60.2 142.11,196.85 137.03,196.85 C67.2 123.06,194.31 | Y1.2 123.06,199.39 123.06,194.31
  Top 0.813: 123.06,194.31 123.06,191.77 121.79,190.5 C57.2 C56.- | C62.2 D5.C 70.99,144.78 67.18,140.97 C55.+ 62.1,140.97 | 62.1,140.97 D2.C | 62.1,132.08 58.29,132.08 C42.2 51.94,120.65 51.94,107.95 E42.7 C41.2 | 62.1,132.08 62.1,140.97 | E5.3 R2.1 | 199.26,180.34 E18.10 195.45,177.8 195.45,166.37 C18.2 | 199.26,180.34 206.88,172.72 206.88,142.24 E12.7 C12.2 211.96,127 211.96,106.68 E11.7 C11.2 211.96,93.98 211.96,68.58 E10.8 C10.2 E9.1 211.96,45.72 C9.2 | E13.3 204.34,185.42 199.26,180.34 | 253.87,181.61 E5.3 | C5.2 253.87,167.64 253.87,181.61 | 253.87,181.61 E5.10 | C13.2 214.5,166.37 214.5,177.8 E13.10 E13.3 | C66.- D8.A 45.59,203.2 31.62,203.2 J1.B J1.A J1.C 22.73,193.04 22.73,149.86 | C9.2 C14.2 | v255.14,17.78 252.6,20.32 C1.2 252.6,45.72 250.06,48.26 | 250.06,48.26 E1.1 | 250.06,48.26 250.06,55.88 C2.2 E2.7 251.33,71.12 C3.2 E3.7 251.33,106.68 C4.2 251.33,133.35 248.79,135.89 E4.7 | U$2.BF2 175.13,8.89 175.13,17.78 | C52.- 173.86,17.78 175.13,17.78 | E14.1 C15.2 189.1,66.04 | C43.2 E44.7 31.62,71.12 31.62,90.17 C44.2 E45.7 | 22.73,149.86 J1.UU J1.VV | C27.2 131.95,46.99 E27.1 E28.8 131.95,68.58 131.95,92.71 C28.2 E29.7 131.95,106.68 C29.2 131.95,143.51 R20.2 | 152.27,49.53 E23.1 | 152.27,66.04 152.27,68.58 E24.7 | 152.27,66.04 152.27,49.53 | 152.27,66.04 159.89,66.04 162.43,68.58 E19.7 172.59,68.58 | C6.2 E6.8 231.01,68.58 231.01,93.98 C7.2 E7.7 231.01,106.68 231.01,114.3 E7.2 225.93,119.38 225.93,120.65 231.01,125.73 231.01,128.27 C8.2 E8.7 | 172.59,68.58 172.59,88.9 C19.2 171.32,92.71 171.32,104.14 | 189.1,66.04 E15.7 191.64,71.12 191.64,92.71 C16.2 E16.7 | 172.59,68.58 175.13,66.04 189.1,66.04
  Top 0.813: C17.2 189.1,133.35 E17.7 | v104.01,154.94 104.01,116.84 E32.4 E32.5 106.55,110.49 105.28,109.22 105.28,106.68 106.55,105.41 E32.7 C32.2 | 171.32,104.14 E20.7 | E22.9 E22.10 | E22.15 E22.14 | T1.4 152.27,185.42 152.27,180.34 T1.8 151,176.53 C26.2 152.27,163.83 152.27,139.7 E26.8 C25.2 152.27,106.68 E25.7 C24.2 152.27,92.71 152.27,66.04
  Bottom 0.813: U$2.AC2 255.14,8.26 v255.14,17.78 252.6,17.78 250.06,15.24 244.98,15.24 | 244.98,15.24 233.55,15.24 231.01,17.78 v225.93,17.78 225.93,8.89 | 225.93,8.89 225.93,8.26 U$2.AN2 225.93,8.89 | U$2.AF2 244.98,8.26 244.98,15.24 | C60.2 144.65,191.77 T1.4 | U$2.BC2 185.29,8.89 v185.29,17.78 180.21,17.78 177.67,15.24 175.13,15.24 | U$2.CC1 121.79,8.89 v121.79,19.05 111.63,19.05 | 111.63,19.05 107.82,20.32 C53.- 104.01,20.32 100.2,16.51 92.58,16.51 | U$2.CF1 111.63,8.89 111.63,19.05 | U$2.CT1 79.88,8.89 v79.88,17.78 v92.58,17.78 92.58,16.51 | U$2.CN1 92.58,8.89 92.58,16.51 | U$2.DT2 10.03,8.89 v10.03,19.05 13.84,16.51 22.73,16.51 | 22.73,16.51 40.51,16.51 | 40.51,16.51 C54.- 46.86,20.32 51.94,15.24 51.94,8.26 U$2.DC2 | U$2.DN2 22.73,8.26 22.73,16.51 | U$2.DF2 41.78,8.26 41.78,15.24 40.51,16.51 | U$2.BN2 156.08,8.89 156.08,15.24 | 156.08,15.24 175.13,15.24 | 156.08,16.51 156.08,15.24 | 156.08,16.51 143.38,16.51 | U$2.BT2 143.38,8.89 143.38,16.51 | 143.38,16.51 v143.38,17.78 | v156.08,17.78 156.08,16.51 | U$2.BF2 175.13,8.89 175.13,15.24 | U$2.AT2 213.23,8.89 213.23,13.97 v215.77,16.51 | C47.2 15.11,90.17 24,90.17 27.81,92.71 C44.2 31.62,90.17 45.59,90.17 48.13,92.71 C41.2 | E21.7 167.51,139.7 162.43,144.78 C49.2 | 133.22,149.86 DL1.2 123.06,152.4 106.55,152.4 v104.01,154.94 101.47,157.48 92.58,157.48 90.04,154.94 | 133.22,149.86 R20.2 | 133.22,149.86 139.57,149.86 143.38,146.05 143.38,140.97 E26.8 | 173.86,195.58 C22.2 | 173.86,195.58 175.13,196.85 180.21,196.85 186.56,187.96 E18.2 | E18.10 E18.3 | E22.8 E22.9 | E16.7 190.37,104.14 192.91,106.68 192.91,111.76 E16.12 197.99,114.3 206.88,104.14 E11.7
  Bottom 0.813: E7.2 232.28,115.57 | 232.28,115.57 E7.12 | E36.11 95.12,147.32 90.04,154.94 | 232.28,115.57 232.28,119.38 234.82,121.92 258.95,121.92 260.22,120.65 260.22,116.84 E3.12 | E17.7 191.64,139.7 192.91,140.97 192.91,156.21 194.18,157.48 199.26,157.48 200.53,156.21 200.53,142.24 203.07,139.7 E12.7 | E22.15 176.4,187.96 175.13,189.23 175.13,194.31 173.86,195.58 | C7.2 232.28,97.79 246.25,97.79 C3.2 | C5.2 253.87,167.64 228.47,167.64 225.93,165.1 C13.2 | C48.2 17.65,130.81 C45.2 | E31.8 104.01,68.58 104.01,72.39 100.2,76.2 E34.11 | E10.8 213.23,62.23 224.66,62.23 E6.8 | E25.7 C50.2 | C38.2 72.26,97.79 77.34,97.79 79.88,95.25 87.5,95.25 C35.2 | C8.2 232.28,127 248.79,127 C4.2 | 90.04,154.94 E36.1
  pour Top: 120.52,196.85 130.68,196.85 130.68,184.15 120.52,184.15
INIT_L  (via drill 0.81)
  Top 0.406: v45.59,92.71 45.59,88.9 49.4,85.09 E41.1 | E35.11 97.66,111.76 97.66,100.33 96.39,99.06 96.39,96.52 98.93,93.98 v98.93,87.63 | v106.55,88.9 E31.1 | v124.33,87.63 E28.1 | E20.4 166.24,107.95 v166.24,83.82
  Bottom 0.406: E35.11 E35.5 | E38.13 82.42,81.28 84.96,83.82 | v45.59,92.71 46.86,93.98 53.21,93.98 57.02,90.17 77.34,90.17 79.88,87.63 81.15,87.63 84.96,83.82 | 84.96,83.82 87.5,86.36 93.85,86.36 95.12,87.63 v98.93,87.63 102.74,83.82 E31.1 | v166.24,83.82 163.7,86.36 133.22,86.36 131.95,87.63 v124.33,87.63 117.98,87.63 116.71,88.9 v106.55,88.9
INITIALIZE  (via drill 0.81)
  Top 0.406: U$2.CR1 86.23,8.89 86.23,17.78 81.15,22.86 81.15,50.8 79.88,52.07 79.88,71.12 83.69,74.93 83.69,95.25 v81.15,97.79 | v91.31,100.33 92.58,101.6 92.58,138.43 E36.9
  Bottom 0.406: v81.15,97.79 86.23,100.33 v91.31,100.33
INT_ENAB  (via drill 0.81)
  Top 0.406: E37.12 78.61,46.99 78.61,50.8 77.34,52.07 77.34,67.31 E38.8 | U$2.CB1 124.33,8.89 124.33,20.32 120.52,24.13 v120.52,52.07
  Bottom 0.406: E37.12 72.26,46.99 72.26,49.53 74.8,52.07 91.31,52.07 93.85,54.61 109.09,54.61 110.36,53.34 119.25,53.34 v120.52,52.07
INT_RQST_L  (via drill 0.81)
  Top 0.406: U$2.CP1 90.04,8.89 90.04,16.51 83.69,22.86 v83.69,36.83
  Bottom 0.406: E37.13 79.88,46.99 v83.69,36.83
INTERNAL_IO_L  (via drill 0.81)
  Top 0.406: E37.1 65.91,46.99 65.91,44.45 E37.4 65.91,39.37 65.91,30.48 76.07,20.32 v76.07,19.05 | U$2.CL1 98.93,8.89 98.93,17.78 v97.66,19.05
  Bottom 0.406: v76.07,19.05 78.61,21.59 95.12,21.59 v97.66,19.05
IO_PAUSE_L
  Top 0.406: U$2.CD1 117.98,8.89 117.98,19.05 102.74,27.94 102.74,50.8 98.93,54.61 98.93,76.2 E34.12
KSKP  (via drill 0.81)
  Top 0.406: v20.19,105.41 18.92,104.14 18.92,82.55 E47.13
  Bottom 0.406: v20.19,105.41 E45.5
LAST_UNIT  (via drill 0.81)
  Top 0.406: v101.47,121.92 101.47,154.94 96.39,160.02 v96.39,172.72 | E8.5 231.01,147.32 231.01,162.56 v228.47,165.1
  Bottom 0.406: E39.13 81.15,121.92 92.58,121.92 93.85,123.19 100.2,123.19 v101.47,121.92 | v228.47,165.1 227.2,163.83 168.78,163.83 161.16,171.45 140.84,171.45 137.03,167.64 128.14,167.64 120.52,173.99 97.66,173.99 v96.39,172.72
LINE  (via drill 0.81)
  Top 0.406: U$2.DA1 58.29,8.26 58.29,16.51 59.56,17.78 65.91,17.78 67.18,19.05 67.18,27.94 64.64,30.48 64.64,52.07 65.91,53.34 65.91,64.77 64.64,66.04 v64.64,69.85 | v101.47,72.39 101.47,93.98 98.93,96.52 98.93,99.06 101.47,101.6 v101.47,114.3
  Bottom 0.406: v101.47,114.3 E32.2 110.36,118.11 114.17,121.92 129.41,121.92 131.95,119.38 131.95,111.76 E29.5 | v64.64,69.85 64.64,67.31 67.18,64.77 77.34,64.77 78.61,66.04 100.2,66.04 101.47,67.31 v101.47,72.39
MD03  (via drill 0.81)
  Top 0.406: U$2.AP1 223.39,8.89 223.39,20.32 v231.01,27.94
  Bottom 0.406: E1.10 258.95,35.56 258.95,31.75 257.68,30.48 248.79,30.48 246.25,27.94 v231.01,27.94 B.4
MD04  (via drill 0.81)
  Top 0.406: v248.79,16.51 E1.7 | U$2.BK1 166.24,8.89 166.24,19.05 v167.51,20.32
  Bottom 0.406: E1.7 244.98,29.21 242.44,29.21 A.4 | v248.79,16.51 234.82,16.51 232.28,19.05 224.66,19.05 222.12,16.51 219.58,16.51 218.31,17.78 208.15,17.78 206.88,19.05 197.99,19.05 192.91,22.86 181.48,22.86 173.86,17.78 170.05,17.78 v167.51,20.32
MD05
  Top 0.406: U$2.BL1 162.43,8.89 162.43,20.32 158.62,24.13 158.62,35.56 E23.9
  Bottom 0.406: E23.9 158.62,36.83 161.16,39.37 167.51,39.37 168.78,38.1 168.78,34.29 F.3
MD06
  Top 0.406: U$2.BM1 159.89,8.89 159.89,16.51 154.81,21.59 154.81,41.91 E23.12
  Bottom 0.406: E.3 JE13.1 175.13,38.1 173.86,39.37 168.78,39.37 167.51,40.64 161.16,40.64 E23.12
MD07
  Top 0.406: U$2.BP1 153.54,8.89 153.54,17.78 148.46,22.86 148.46,33.02 E23.7
  Bottom 0.406: JD24.1 D.4 176.4,27.94 162.43,27.94 154.81,33.02 152.27,33.02 E23.7
MD08  (via drill 0.81)
  Top 0.406: U$2.DK1 32.89,8.26 v32.89,19.05 | C.4 220.85,30.48 v220.85,17.78
  Bottom 0.406: C.4 JC24.1 222.12,38.1 225.93,41.91 244.98,41.91 E1.4 | v32.89,19.05 37.97,22.86 41.78,22.86 43.05,24.13 46.86,24.13 48.13,22.86 63.37,22.86 129.41,22.86 130.68,21.59 144.65,21.59 147.19,19.05 153.54,19.05 154.81,20.32 162.43,20.32 164.97,22.86 178.94,22.86 181.48,24.13 192.91,24.13 197.99,20.32 208.15,20.32 209.42,19.05 219.58,19.05 v220.85,17.78
MD09  (via drill 0.81)
  Top 0.406: U$2.DL1 29.08,8.26 v29.08,19.05
  Bottom 0.406: v29.08,19.05 27.81,20.32 24,20.32 22.73,19.05 16.38,19.05 12.57,22.86 7.49,22.86 6.22,24.13 6.22,31.75 E46.7
MD10  (via drill 0.81)
  Top 0.406: U$2.DM1 26.54,8.26 v26.54,19.05
  Bottom 0.406: v26.54,19.05 25.27,17.78 15.11,17.78 11.3,21.59 6.22,21.59 4.95,22.86 4.95,40.64 8.76,41.91 E46.4
MD11
  Top 0.406: U$2.DP1 20.19,8.89 20.19,24.13 21.46,25.4 21.46,33.02 E46.9
N$1
  Top 0.406: JF24.1 164.97,34.29 167.51,34.29 168.78,35.56 168.78,38.1 170.05,39.37 187.83,39.37 E14.5
  Bottom 0.406: F.4 JF24.1
N$2  (via drill 0.81)
  Top 0.406: E34.6 86.23,68.58 86.23,66.04 90.04,62.23 v91.31,62.23 | E14.11 195.45,41.91 195.45,50.8 199.26,54.61 v199.26,62.23
  Bottom 0.406: E9.5 204.34,40.64 E14.11 | E34.6 86.23,72.39 86.23,77.47 E34.3 | v91.31,62.23 92.58,63.5 101.47,63.5 102.74,62.23 111.63,62.23 112.9,60.96 115.44,60.96 117.98,58.42 144.65,58.42 145.92,59.69 156.08,59.69 157.35,60.96 180.21,60.96 181.48,62.23 v199.26,62.23
N$3  (via drill 0.81)
  Top 0.406: v228.47,40.64 222.12,40.64 E9.9
  Bottom 0.406: A.3 JA13.1 243.71,38.1 241.17,40.64 v228.47,40.64
N$4  (via drill 0.81)
  Top 0.406: E37.5 E37.6 | v204.34,52.07 206.88,49.53 206.88,45.72 E9.3 | v63.37,54.61 63.37,64.77 59.56,68.58 59.56,115.57 E42.13
  ECO2 0.406: v63.37,54.61 135.76,54.61 148.46,41.91 E23.4
  Bottom 0.406: E37.5 65.91,39.37 63.37,41.91 v63.37,54.61 91.31,54.61 93.85,57.15 109.09,57.15 110.36,55.88 137.03,55.88 140.84,52.07 153.54,52.07 154.81,53.34 159.89,53.34 162.43,55.88 185.29,55.88 187.83,53.34 203.07,53.34 v204.34,52.07 | 147.19,41.91 E23.4 151,41.91 153.54,44.45
N$5
  Top 0.406: E37.3 E37.2
  ECO1 0.406: E33.9 E33.8
  ECO2 0.406: E37.2 65.91,49.53 65.91,52.07 67.18,53.34 95.12,53.34 97.66,50.8 97.66,36.83 E33.9 | E33.8 97.66,34.29 97.66,31.75 144.65,31.75 147.19,34.29 147.19,38.1 148.46,39.37 E23.5 148.46,38.1 148.46,33.02 152.27,29.21 185.29,29.21 186.56,30.48 186.56,40.64 E14.3
  Bottom 0.406: E37.2 70.99,48.26 70.99,50.8 73.53,53.34 91.31,53.34 93.85,55.88 109.09,55.88 110.36,54.61 137.03,54.61 145.92,41.91 | E14.3 187.83,43.18 184.02,39.37 177.67,39.37 176.4,40.64 170.05,40.64 167.51,43.18 162.43,43.18 159.89,45.72 159.89,49.53 158.62,50.8 154.81,50.8 153.54,49.53 153.54,45.72
N$8
  Bottom 0.406: E38.12 E34.2
N$9
  Top 0.406: T1.7 T1.6
N$10
  Bottom 0.406: E45.4 22.73,119.38 22.73,123.19 25.27,125.73 31.62,125.73 34.16,128.27 40.51,128.27 43.05,125.73 50.67,125.73 53.21,123.19 59.56,123.19 62.1,120.65 62.1,116.84 E42.11
N$11
  Top 0.406: T1.3 T1.2
N$12
  Top 0.406: T1.14 T1.15
N$13
  Top 0.406: T1.12 T1.13
N$14  (via drill 0.81)
  Top 0.406: E46.11 E46.12 15.11,46.99 15.11,57.15 v17.65,59.69 | v101.47,59.69 101.47,69.85 100.2,71.12 100.2,93.98 97.66,96.52 97.66,99.06 98.93,100.33 98.93,113.03 E35.12 E35.13 98.93,120.65 98.93,152.4 E36.14
  Bottom 0.406: v17.65,59.69 24,59.69 27.81,57.15 49.4,57.15 54.48,53.34 59.56,53.34 62.1,57.15 67.18,57.15 68.45,55.88 91.31,55.88 93.85,58.42 93.85,59.69 95.12,60.96 100.2,60.96 v101.47,59.69
N$15
  Top 0.406: T1.10 T1.11
N$16
  Top 0.406: E41.3 51.94,81.28 51.94,85.09 46.86,90.17 46.86,107.95 E42.5
N$17  (via drill 0.81)
  Top 0.406: v65.91,102.87 65.91,88.9 69.72,85.09 69.72,77.47 E38.4
  Bottom 0.406: E42.6 54.48,102.87 v65.91,102.87
N$19  (via drill 0.81)
  Top 0.406: E45.10 40.51,114.3 40.51,120.65 v46.86,127
  Bottom 0.406: E39.2 60.83,124.46 53.21,124.46 50.67,127 v46.86,127
N$20
  Bottom 0.406: E39.6 65.91,109.22 59.56,109.22 E42.9
N$21  (via drill 0.81)
  Top 0.406: E43.14 39.24,46.99 39.24,50.8 v36.7,53.34
  Bottom 0.406: E40.14 51.94,46.99 51.94,50.8 50.67,52.07 46.86,52.07 45.59,50.8 E43.14 | E46.3 13.84,46.99 13.84,50.8 15.11,52.07 26.54,52.07 27.81,53.34 v36.7,53.34
N$22  (via drill 0.81)
  Top 0.406: E37.8 E37.9 | v60.83,31.75 62.1,33.02 62.1,64.77 58.29,68.58 58.29,104.14 E42.8
  Bottom 0.406: E37.8 73.53,31.75 v60.83,31.75
N$23  (via drill 0.81)
  Top 0.406: v45.59,55.88 E40.1 | v26.54,54.61 E43.1
  Bottom 0.406: E46.2 6.22,49.53 6.22,50.8 10.03,54.61 v26.54,54.61 27.81,55.88 v45.59,55.88
N$25